# Altium project SLT_110.PrjPcb (part 1 of 3)
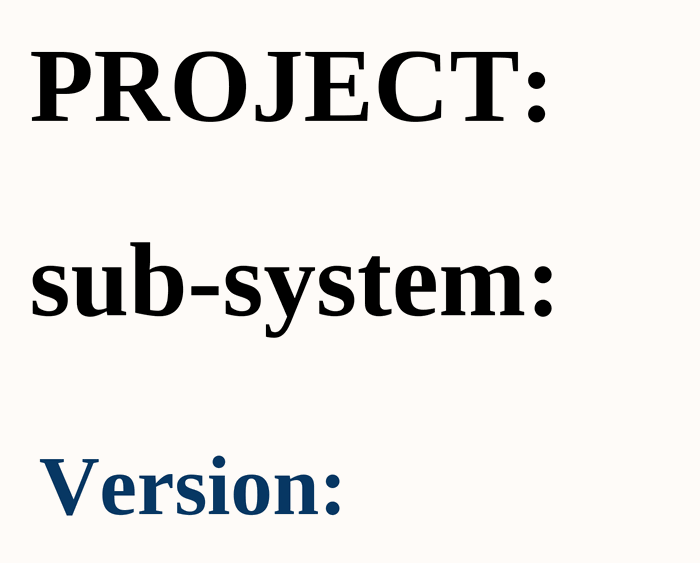
[diagram p0: COVER PAGE.SchDoc]
ApprovedBy: Vu Pham; CheckedBy: Bao Bui; Date: 09/29/2025; DrawnBy: Cam Doan; MasterProject: SLT 6U Satellite; Revision: 1.1.0; SubSystem: SLT 6U Satellite
21 sheets, 876 parts. Net scope: global (net labels, ports and power ports of the same name join across sheets).
Board file: SLT.PcbDoc
Sheets:
  COVER PAGE.SchDoc
  BLOCK DIAGRAM.SchDoc
  INDEX.SchDoc
  CONNECTOR.SchDoc
  POWER.SchDoc
  POWER_2.SchDoc
  SOM_POWER.SchDoc
  SOM_BOOT.SchDoc
  SOM_Console.SchDoc
  IO_EXPAND.SchDoc
  CAN_I2C.SchDoc
  USB.SchDoc
  LED.SchDoc
  TEC.SchDoc
  HEATER.SchDoc
  NTC.SchDoc
  FLUIDIC_CTRL.SchDoc
  SOLEDNOID.SchDoc
  ADC.SchDoc
  I2C_Sensor.SchDoc
  MOUTING.SchDoc

## Sheet COVER PAGE.SchDoc
size 420 x 297 mm; SheetNumber: 1; SheetTotal: 17

### Notes on the sheet
- PROJECT:
- sub-system:
- Version:
- Project:
- Sub-system:
- Design by:
- Sheet title:
- Sheet
- of
- Checked by:
- Approved by:
- Revision:
- Document No:
- Size:
- Date:
- A3

## Sheet BLOCK DIAGRAM.SchDoc
size 420 x 297 mm; SheetNumber: 2; SheetTotal: 17

### Notes on the sheet
- Project:
- Sub-system:
- Design by:
- Sheet title:
- Sheet
- of
- Checked by:
- Approved by:
- Revision:
- Document No:
- Size:
- Date:
- A3

## Sheet INDEX.SchDoc
size 420 x 297 mm; SheetNumber: 3; SheetTotal: 17
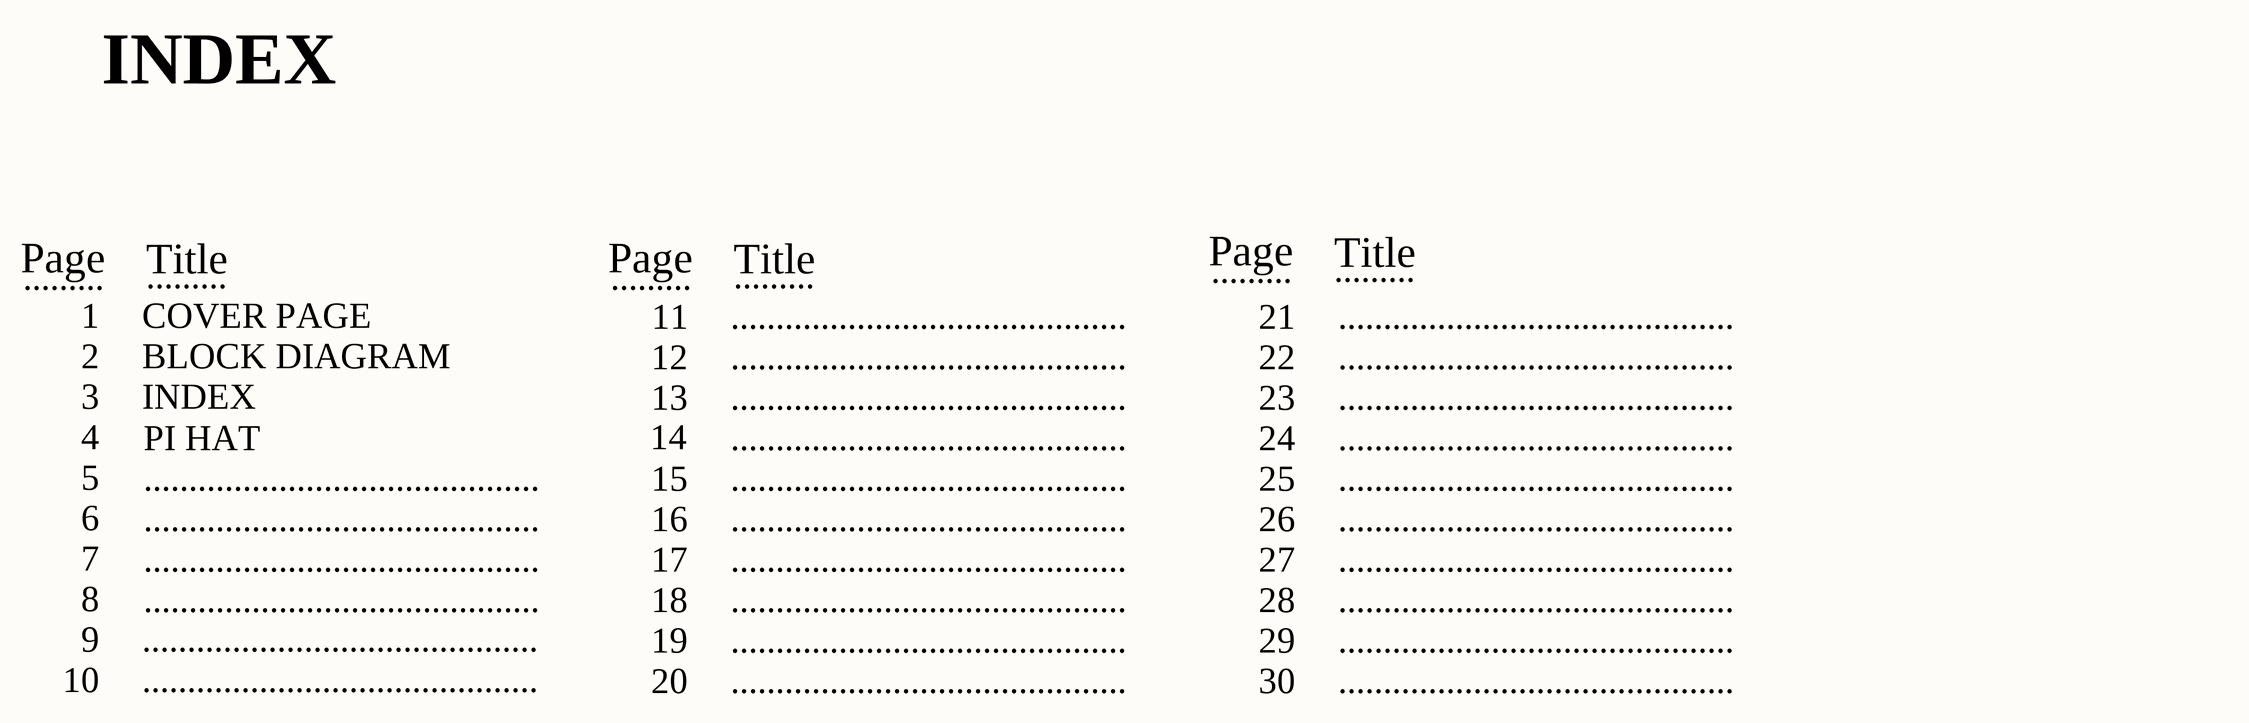
[diagram p1: INDEX.SchDoc]

### Notes on the sheet
- INDEX
- Page
- .........
- Title
- 1
- 2
- COVER PAGE
- BLOCK DIAGRAM
- 11
- 12
- ............................................
- 21
- 22
- 3
- 4
- 14
- 13
- 23
- 5
- PI HAT
- 15
- 24
- 25
- 6
- 7
- 16
- 17
- 26
- 27
- 8
- 18
- 28
- 9
- 10
- 19
- 20
- 29
- 30
- Project:
- Sub-system:
- Design by:
- Sheet title:
- Sheet
- of
- Checked by:
- Approved by:
- Revision:
- Document No:
- Size:
- Date:
- A3

## Sheet CONNECTOR.SchDoc
size 420 x 297 mm; SheetNumber: 4; SheetTotal: 21
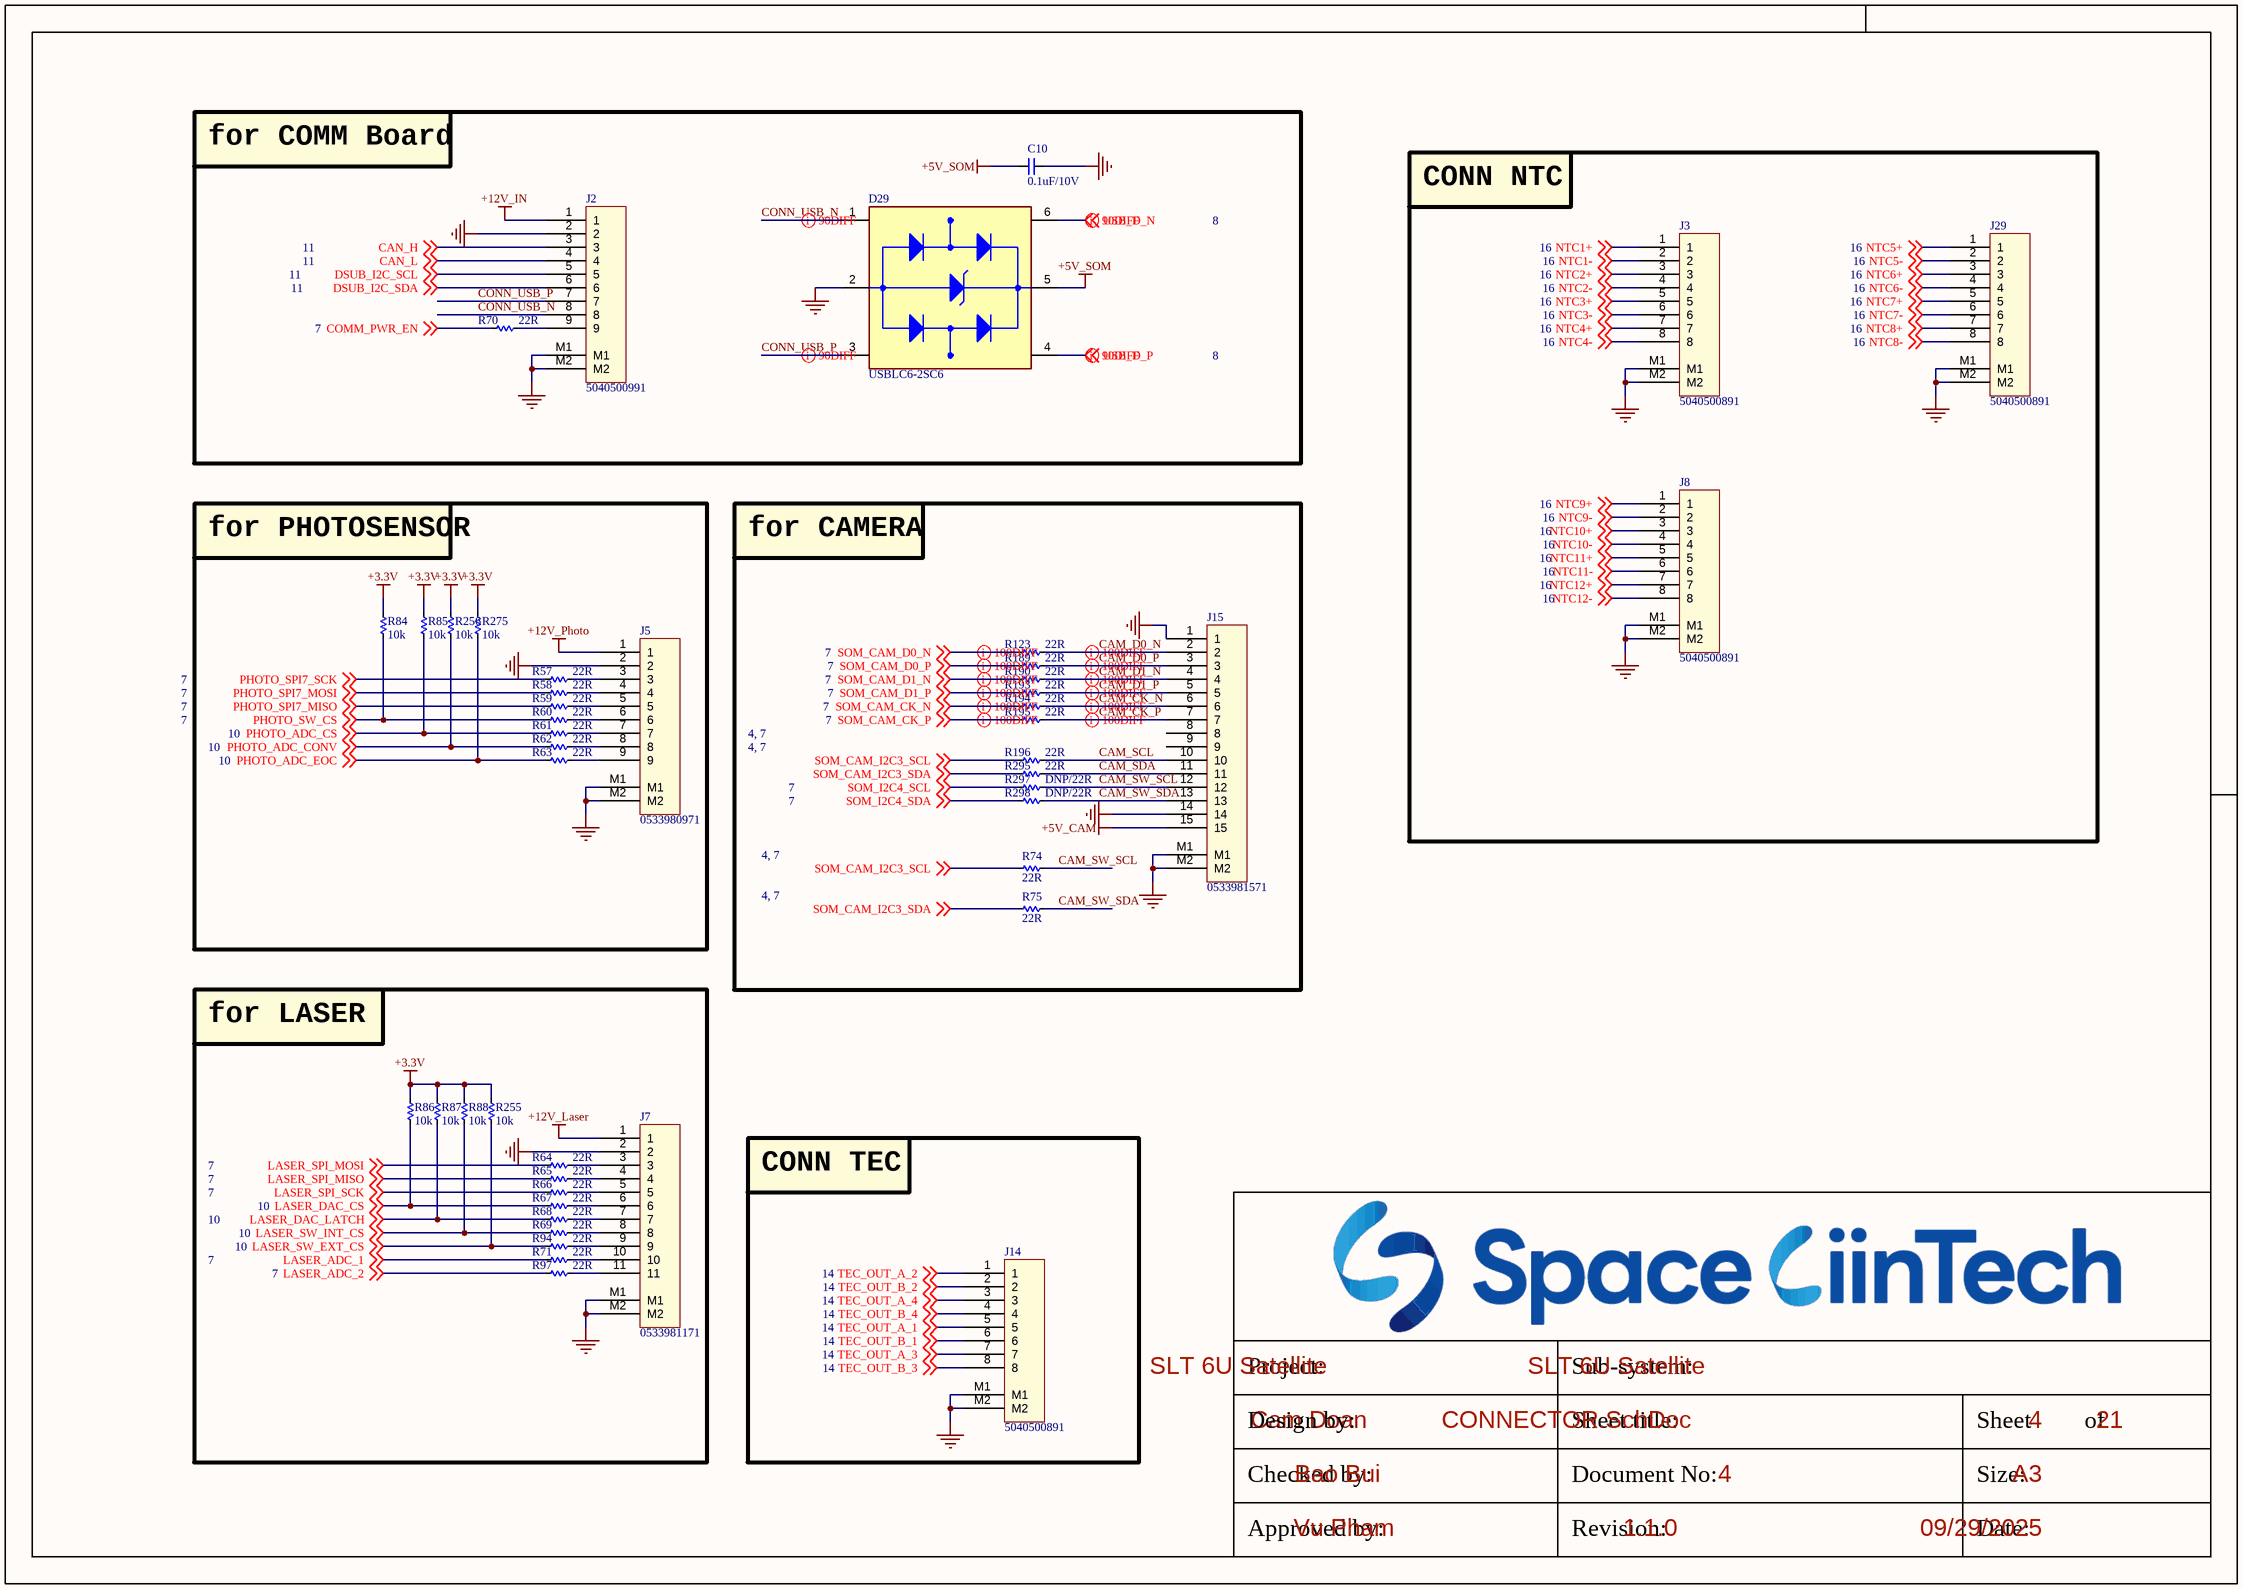
[diagram p2: CONNECTOR.SchDoc]

### Parts
C10  0.1uF/10V  [CAP_C_1005X60]
D29  USBLC6-2SC6  [SOT95P280X145-6N]
J2  5040500991  [Molex_5040500991]
J3  5040500891  [MOLEX_5040500891]
J5  0533980971  [MOLEX_0533980971]
J7  0533981171  [MOLEX_0533981171]
J8  5040500891  [MOLEX_5040500891]
J14  5040500891  [MOLEX_5040500891]
J15  0533981571  [MOLEX_0533981571]
J29  5040500891  [MOLEX_5040500891]
R57  22R  [RES_C_1005X40]
R58  22R  [RES_C_1005X40]
R59  22R  [RES_C_1005X40]
R60  22R  [RES_C_1005X40]
R61  22R  [RES_C_1005X40]
R62  22R  [RES_C_1005X40]
R63  22R  [RES_C_1005X40]
R64  22R  [RES_C_1005X40]
R65  22R  [RES_C_1005X40]
R66  22R  [RES_C_1005X40]
R67  22R  [RES_C_1005X40]
R68  22R  [RES_C_1005X40]
R69  22R  [RES_C_1005X40]
R70  22R  [RES_C_1005X40]
R71  22R  [RES_C_1005X40]
R74  22R  [RES_C_1005X40]
R75  22R  [RES_C_1005X40]
R84  10k  [RES_C_1005X40]
R85  10k  [RES_C_1005X40]
R86  10k  [RES_C_1005X40]
R87  10k  [RES_C_1005X40]
R88  10k  [RES_C_1005X40]
R94  22R  [RES_C_1005X40]
R97  22R  [RES_C_1005X40]
R123  22R  [RES_C_1005X40]
R189  22R  [RES_C_1005X40]
R190  22R  [RES_C_1005X40]
R193  22R  [RES_C_1005X40]
R194  22R  [RES_C_1005X40]
R195  22R  [RES_C_1005X40]
R196  22R  [RES_C_1005X40]
R255  10k  [RES_C_1005X40]
R256  10k  [RES_C_1005X40]
R275  10k  [RES_C_1005X40]
R295  22R  [RES_C_1005X40]
R297  DNP/22R  [RES_C_1005X40]
R298  DNP/22R  [RES_C_1005X40]

### Blocks framed on the sheet
for COMM Board: C10 D29 J2 R70
CONN NTC: J3 J8 J29
for PHOTOSENSOR: J5 R57-R63 R84 R85 R256 R275
for CAMERA: J15 R74 R75 R123 R189 R190 R193-R196 R295 R297 R298
for LASER: J7 R64-R69 R71 R86-R88 R94 R97 R255
CONN TEC: J14

### Nets
+3.3V: R84.1 R85.1 R86.1 R87.1 R88.1 R255.1 R256.1 R275.1
+5V_CAM: J15.15
+5V_SOM: C10.2 D29.5(VBUS)
+12V_IN: J2.1
+12V_Laser: J7.1
+12V_Photo: J5.1
GND: C10.1 D29.2(GND) J2.2 J2.M1 J2.M2 J3.M1 J3.M2 J5.2 J5.M1 J5.M2 J7.2 J7.M1 J7.M2 J8.M1 J8.M2 J14.M1 J14.M2 J15.1 J15.14 J15.M1 J15.M2 J29.M1 J29.M2
NTC1+: J3.1 J3.3 J3.5 J3.7 J8.1 J8.3 J8.5 J8.7 J29.1 J29.3 J29.5 J29.7 ; off-sheet NTC1+, off-sheet NTC2+, off-sheet NTC3+, off-sheet NTC4+, off-sheet NTC5+, off-sheet NTC6+, off-sheet NTC7+, off-sheet NTC8+, off-sheet NTC9+, off-sheet NTC10+, off-sheet NTC11+, off-sheet NTC12+  [also labelled NTC10+, NTC11+, NTC12+, NTC2+, NTC3+, NTC4+, NTC5+, NTC6+, NTC7+, NTC8+, NTC9+]
CAM_CK_N: J15.6 R194.2
CAM_CK_P: J15.7 R195.2
CAM_D0_N: J15.2 R123.2
CAM_D0_P: J15.3 R189.2
CAM_D1_N: J15.4 R190.2
CAM_D1_P: J15.5 R193.2
CAM_SCL: J15.10 R196.2
CAM_SDA: J15.11 R295.2
CAM_SW_SCL: J15.12 R74.1 R297.2
CAM_SW_SDA: J15.13 R75.1 R298.2
CAN_H: J2.3 ; off-sheet CAN_H
CAN_L: J2.4 ; off-sheet CAN_L
COMM_PWR_EN: R70.1 ; off-sheet COMM_PWR_EN
CONN_USB_N: D29.1(I/O1_IN) J2.8
CONN_USB_P: D29.3(I/O2_IN) J2.7
DSUB_I2C_SCL: J2.5 ; off-sheet DSUB_I2C_SCL
DSUB_I2C_SDA: J2.6 ; off-sheet DSUB_I2C_SDA
LASER_ADC_1: R71.1 ; off-sheet LASER_ADC_1
LASER_ADC_2: R97.1 ; off-sheet LASER_ADC_2
LASER_DAC_CS: R67.1 R86.2 ; off-sheet LASER_DAC_CS
LASER_DAC_LATCH: R68.1 R87.2 ; off-sheet LASER_DAC_LATCH
LASER_SPI_MISO: R65.1 ; off-sheet LASER_SPI_MISO  [project net SPI1_MISO]
LASER_SPI_MOSI: R64.1 ; off-sheet LASER_SPI_MOSI  [project net SPI1_MOSI]
LASER_SPI_SCK: R66.1 ; off-sheet LASER_SPI_SCK  [project net SPI1_SCK]
LASER_SW_EXT_CS: R94.1 R255.2 ; off-sheet LASER_SW_EXT_CS
LASER_SW_INT_CS: R69.1 R88.2 ; off-sheet LASER_SW_INT_CS
NTC1-: J3.2 ; off-sheet NTC1-
NTC2-: J3.4 ; off-sheet NTC2-
NTC3-: J3.6 ; off-sheet NTC3-
NTC4-: J3.8 ; off-sheet NTC4-
NTC5-: J29.2 ; off-sheet NTC5-
NTC6-: J29.4 ; off-sheet NTC6-
NTC7-: J29.6 ; off-sheet NTC7-
NTC8-: J29.8 ; off-sheet NTC8-
NTC9-: J8.2 ; off-sheet NTC9-
NTC10-: J8.4 ; off-sheet NTC10-
NTC11-: J8.6 ; off-sheet NTC11-
NTC12-: J8.8 ; off-sheet NTC12-
PHOTO_ADC_CONV: R62.1 R256.2 ; off-sheet PHOTO_ADC_CONV
PHOTO_ADC_CS: R61.1 R85.2 ; off-sheet PHOTO_ADC_CS
PHOTO_ADC_EOC: R63.1 R275.2 ; off-sheet PHOTO_ADC_EOC
PHOTO_SPI7_MISO: R59.1 ; off-sheet PHOTO_SPI7_MISO
PHOTO_SPI7_MOSI: R58.1 ; off-sheet PHOTO_SPI7_MOSI
PHOTO_SPI7_SCK: R57.1 ; off-sheet PHOTO_SPI7_SCK
PHOTO_SW_CS: R60.1 R84.2 ; off-sheet PHOTO_SW_CS
SOM_CAM_CK_N: R194.1 ; off-sheet SOM_CAM_CK_N
SOM_CAM_CK_P: R195.1 ; off-sheet SOM_CAM_CK_P
SOM_CAM_D0_N: R123.1 ; off-sheet SOM_CAM_D0_N
SOM_CAM_D0_P: R189.1 ; off-sheet SOM_CAM_D0_P
SOM_CAM_D1_N: R190.1 ; off-sheet SOM_CAM_D1_N
SOM_CAM_D1_P: R193.1 ; off-sheet SOM_CAM_D1_P
SOM_CAM_I2C3_SCL: R74.2 R196.1 ; off-sheet SOM_CAM_I2C3_SCL
SOM_CAM_I2C3_SDA: R75.2 R295.1 ; off-sheet SOM_CAM_I2C3_SDA
SOM_I2C4_SCL: R297.1 ; off-sheet SOM_I2C4_SCL  [project net I2C4_SCL]
SOM_I2C4_SDA: R298.1 ; off-sheet SOM_I2C4_SDA  [project net I2C4_SDA]
TEC_OUT_A_1: J14.5 ; off-sheet TEC_OUT_A_1
TEC_OUT_A_2: J14.1 ; off-sheet TEC_OUT_A_2
TEC_OUT_A_3: J14.7 ; off-sheet TEC_OUT_A_3
TEC_OUT_A_4: J14.3 ; off-sheet TEC_OUT_A_4
TEC_OUT_B_1: J14.6 ; off-sheet TEC_OUT_B_1
TEC_OUT_B_2: J14.2 ; off-sheet TEC_OUT_B_2
TEC_OUT_B_3: J14.8 ; off-sheet TEC_OUT_B_3
TEC_OUT_B_4: J14.4 ; off-sheet TEC_OUT_B_4
USB_D_N: D29.6(I/O1_OUT) ; off-sheet USB_D_N
USB_D_P: D29.4(I/O2_OUT) ; off-sheet USB_D_P
NetJ2_9: J2.9 R70.2
NetJ5_3: J5.3 R57.2
NetJ5_4: J5.4 R58.2
NetJ5_5: J5.5 R59.2
NetJ5_6: J5.6 R60.2
NetJ5_7: J5.7 R61.2
NetJ5_8: J5.8 R62.2
NetJ5_9: J5.9 R63.2
NetJ7_3: J7.3 R64.2
NetJ7_4: J7.4 R65.2
NetJ7_5: J7.5 R66.2
NetJ7_6: J7.6 R67.2
NetJ7_7: J7.7 R68.2
NetJ7_8: J7.8 R69.2
NetJ7_9: J7.9 R94.2
NetJ7_10: J7.10 R71.2
NetJ7_11: J7.11 R97.2

Not connected (* = marked no-connect by the designer): J15 8 9

### Layout directives
differential pair; differential pair class DIFF90: CONN_USB_N, CONN_USB_P, USB_D_N, USB_D_P
differential pair; differential pair class DIFF100: CAM_CK_N, CAM_CK_P, CAM_D0_N, CAM_D0_P, CAM_D1_N, CAM_D1_P, SOM_CAM_CK_N, SOM_CAM_CK_P, SOM_CAM_D0_N, SOM_CAM_D0_P, SOM_CAM_D1_N, SOM_CAM_D1_P

### Notes on the sheet
- Project:
- Sub-system:
- Design by:
- Sheet title:
- Sheet
- of
- Checked by:
- Approved by:
- Revision:
- Document No:
- Size:
- Date:
- A3

### Library data of the parts
C10 = _CAP_C_2: CAP CHIP
D29 = USBLC6-2SC6: 17V Clamp 5A (8/20Âµs) Ipp Tvs Diode Surface Mount SOT-23-6; MF: STMicroelectronics; Value: *; SnapEDA_Link: https://www.snapeda.com/parts/USBLC6-2SC6/STMicroelectronics/view-part/?ref=snap; Check_prices: https://www.snapeda.com/parts/USBLC6-2SC6/STMicroelectronics/view-part/?ref=eda; Purchase-URL: https://pricing.snapeda.com/search/part/USBLC6-2SC6/?ref=eda; Price: None; Availability: In Stock; Package: SOT-23-6 STMicroelectronics; MP: USBLC6-2SC6
J2 J5 = Header 9x1_2M
J3 J8 J14 J29 = Header 8x1_2M
J7 = Header 11x1_2M
J15 = Header 15x1_2M
R57-R71 R74 R75 R84-R88 R94 R97 R123 R189 R190 R193-R196 R255 R256 R275 R295 R297 R298 = _RES_B_2: RES

## Sheet POWER.SchDoc
size 420 x 297 mm; SheetNumber: 5; SheetTotal: 21
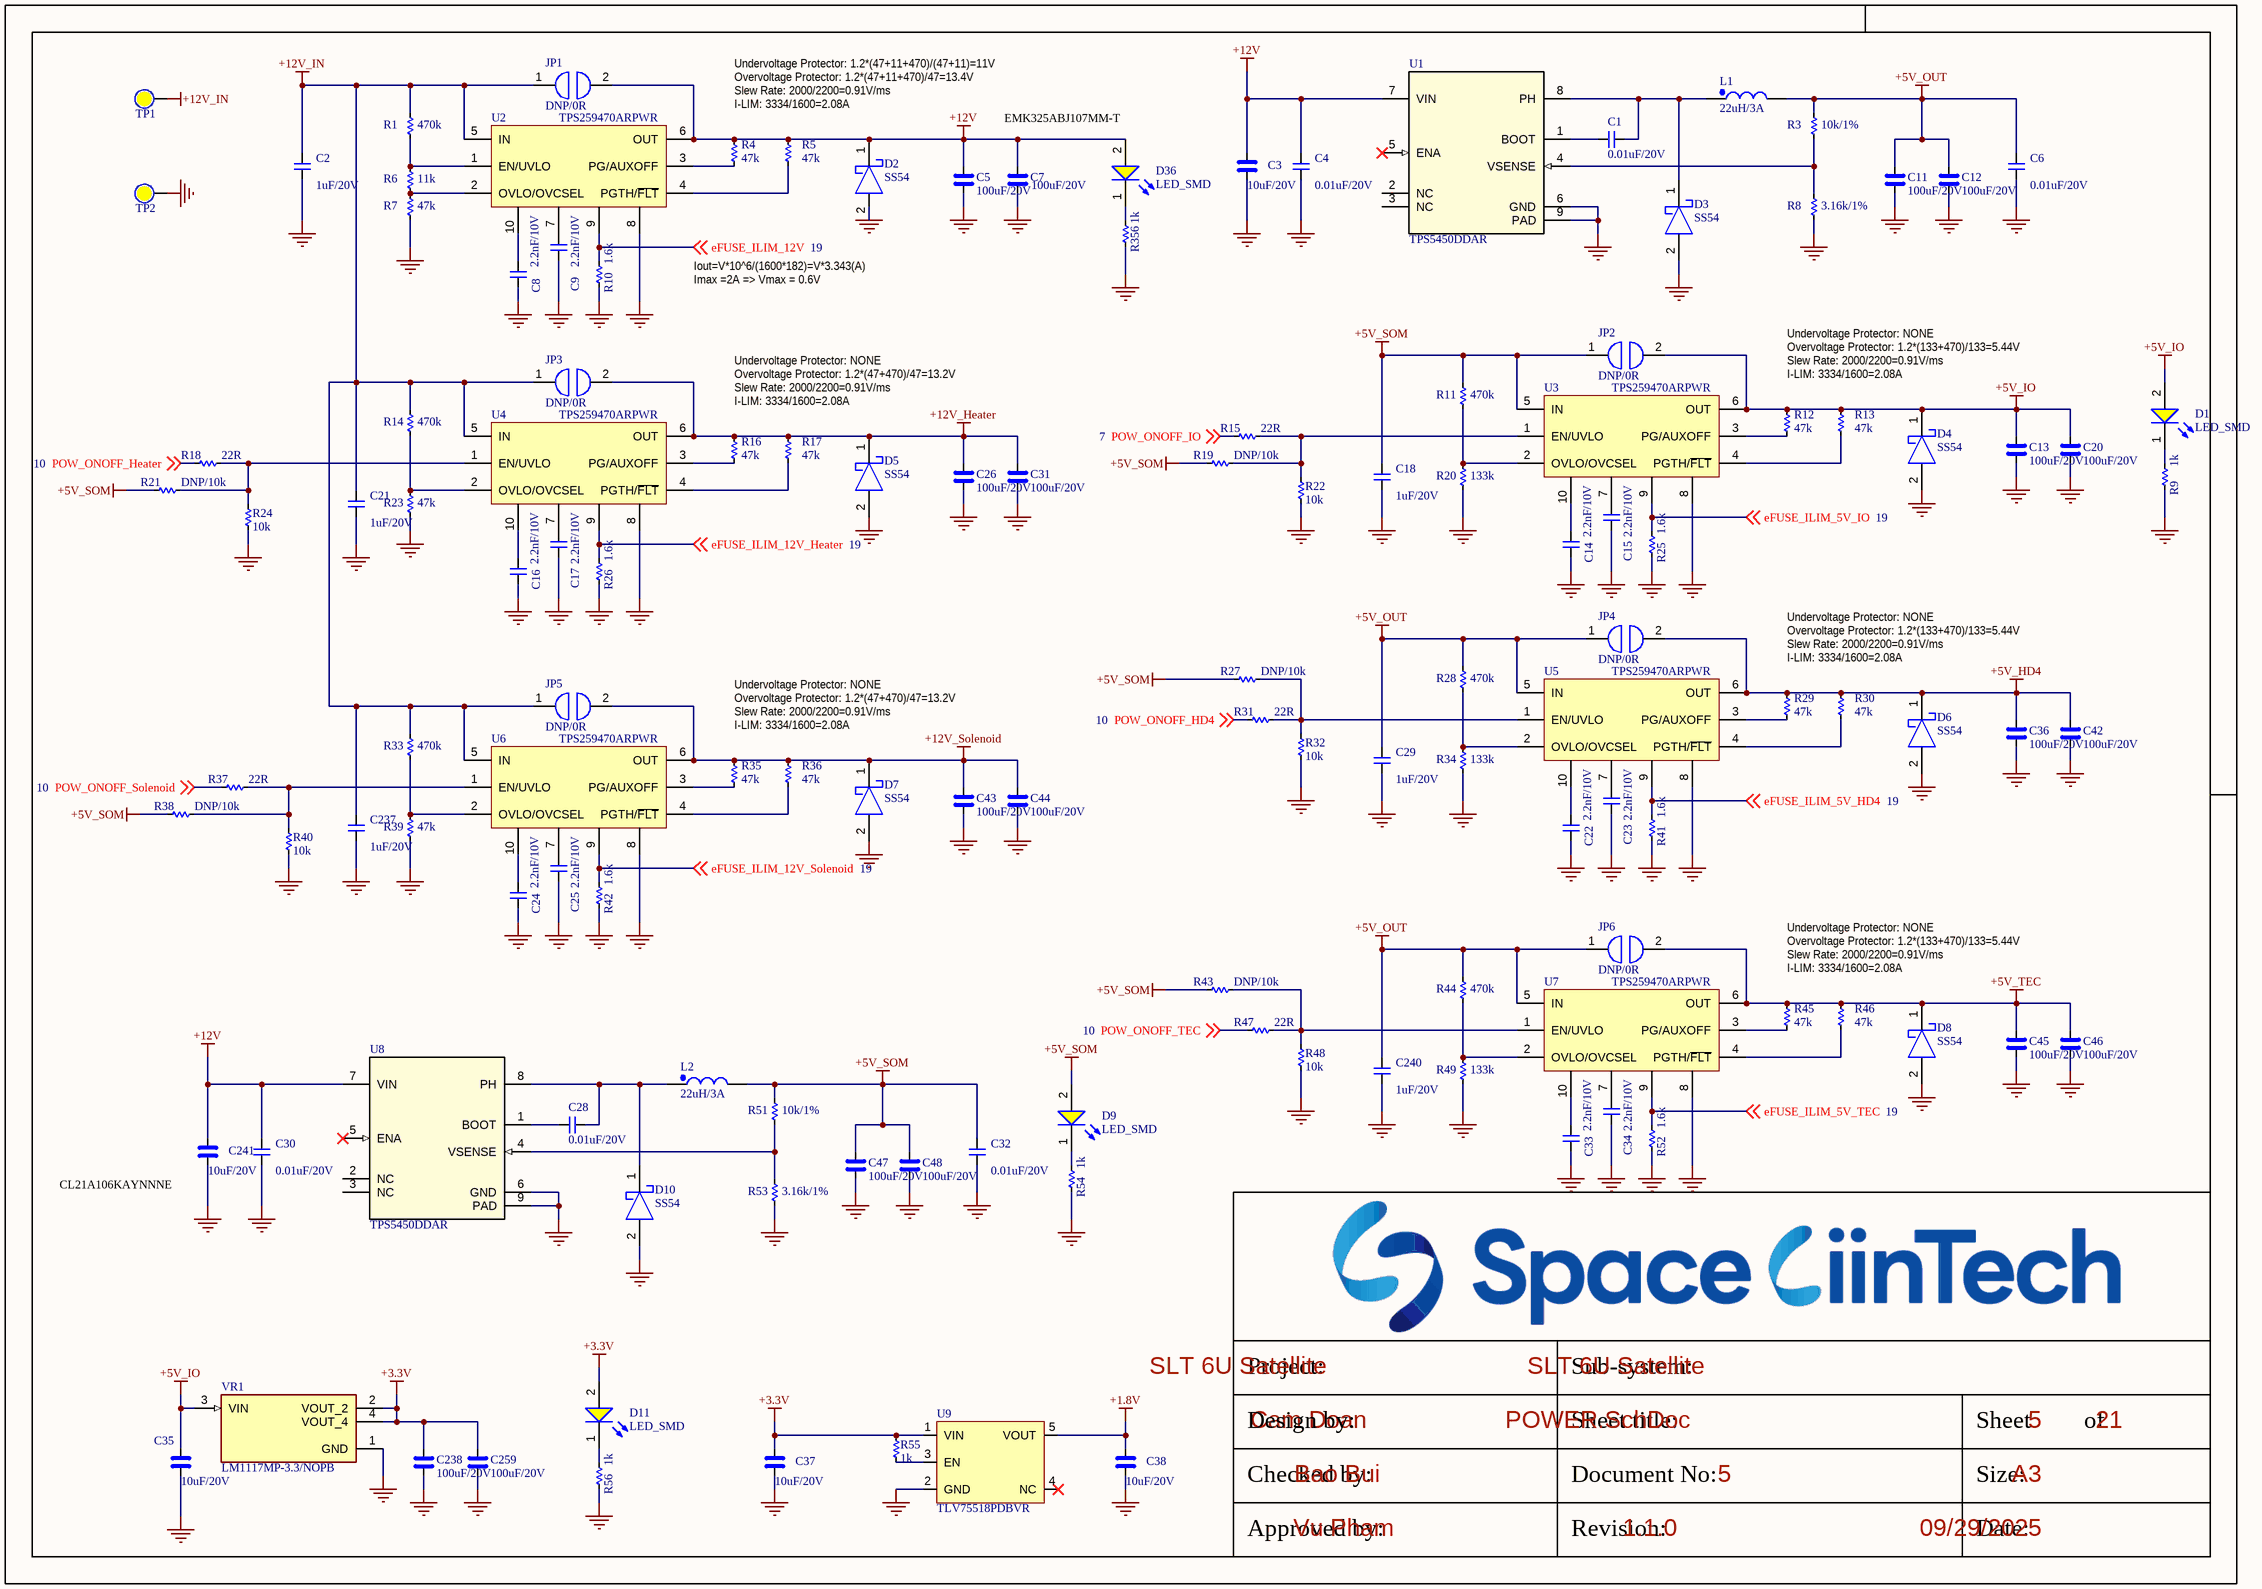
[diagram p3: POWER.SchDoc]

### Parts
C1  0.01uF/20V  [CAP_C_1005X60]
C2  1uF/20V  [CAP_C_1005X60]
C3  10uF/20V  [CAP_C_2012X110]
C4  0.01uF/20V  [CAP_C_1005X60]
C5  100uF/20V  [CAP_C_3225X80]
C6  0.01uF/20V  [CAP_C_1005X60]
C7  100uF/20V  [CAP_C_3225X80]
C8  2.2nF/10V  [CAP_C_1005X60]
C9  2.2nF/10V  [CAP_C_1005X60]
C11  100uF/20V  [CAP_C_3225X80]
C12  100uF/20V  [CAP_C_3225X80]
C13  100uF/20V  [CAP_C_3225X80]
C14  2.2nF/10V  [CAP_C_1005X60]
C15  2.2nF/10V  [CAP_C_1005X60]
C16  2.2nF/10V  [CAP_C_1005X60]
C17  2.2nF/10V  [CAP_C_1005X60]
C18  1uF/20V  [CAP_C_1005X60]
C20  100uF/20V  [CAP_C_3225X80]
C21  1uF/20V  [CAP_C_1005X60]
C22  2.2nF/10V  [CAP_C_1005X60]
C23  2.2nF/10V  [CAP_C_1005X60]
C24  2.2nF/10V  [CAP_C_1005X60]
C25  2.2nF/10V  [CAP_C_1005X60]
C26  100uF/20V  [CAP_C_3225X80]
C28  0.01uF/20V  [CAP_C_1005X60]
C29  1uF/20V  [CAP_C_1005X60]
C30  0.01uF/20V  [CAP_C_1005X60]
C31  100uF/20V  [CAP_C_3225X80]
C32  0.01uF/20V  [CAP_C_1005X60]
C33  2.2nF/10V  [CAP_C_1005X60]
C34  2.2nF/10V  [CAP_C_1005X60]
C35  10uF/20V  [CAP_C_2012X110]
C36  100uF/20V  [CAP_C_3225X80]
C37  10uF/20V  [CAP_C_2012X110]
C38  10uF/20V  [CAP_C_2012X110]
C42  100uF/20V  [CAP_C_3225X80]
C43  100uF/20V  [CAP_C_3225X80]
C44  100uF/20V  [CAP_C_3225X80]
C45  100uF/20V  [CAP_C_3225X80]
C46  100uF/20V  [CAP_C_3225X80]
C47  100uF/20V  [CAP_C_3225X80]
C48  100uF/20V  [CAP_C_3225X80]
C237  1uF/20V  [CAP_C_1005X60]
C238  100uF/20V  [CAP_C_3225X80]
C240  1uF/20V  [CAP_C_1005X60]
C241  10uF/20V  [CAP_C_2012X110]
C259  100uF/20V  [CAP_C_3225X80]
D1  LED_SMD  [LED_0603]
D2  SS54  [DO-214AC_SMA]
D3  SS54  [DO-214AC_SMA]
D4  SS54  [DO-214AC_SMA]
D5  SS54  [DO-214AC_SMA]
D6  SS54  [DO-214AC_SMA]
D7  SS54  [DO-214AC_SMA]
D8  SS54  [DO-214AC_SMA]
D9  LED_SMD  [LED_0603]
D10  SS54  [DO-214AC_SMA]
D11  LED_SMD  [LED_0603]
D36  LED_SMD  [LED_0603]
JP1  DNP/0R  [RES_C_1608X60]
JP2  DNP/0R  [RES_C_1608X60]
JP3  DNP/0R  [RES_C_1608X60]
JP4  DNP/0R  [RES_C_1608X60]
JP5  DNP/0R  [RES_C_1608X60]
JP6  DNP/0R  [RES_C_1608X60]
L1  22uH/3A  [IND730660x480]
L2  22uH/3A  [IND730660x480]
R1  470k  [RES_C_1005X40]
R3  10k/1%  [RES_C_1005X40]
R4  47k  [RES_C_1005X40]
R5  47k  [RES_C_1005X40]
R6  11k  [RES_C_1005X40]
R7  47k  [RES_C_1005X40]
R8  3.16k/1%  [RES_C_1005X40]
R9  1k  [RES_C_1005X40]
R10  1.6k  [RES_C_1005X40]
R11  470k  [RES_C_1005X40]
R12  47k  [RES_C_1005X40]
R13  47k  [RES_C_1005X40]
R14  470k  [RES_C_1005X40]
R15  22R  [RES_C_1005X40]
R16  47k  [RES_C_1005X40]
R17  47k  [RES_C_1005X40]
R18  22R  [RES_C_1005X40]
R19  DNP/10k  [RES_C_1005X40]
R20  133k  [RES_C_1005X40]
R21  DNP/10k  [RES_C_1005X40]
R22  10k  [RES_C_1005X40]
R23  47k  [RES_C_1005X40]
R24  10k  [RES_C_1005X40]
R25  1.6k  [RES_C_1005X40]
R26  1.6k  [RES_C_1005X40]
R27  DNP/10k  [RES_C_1005X40]
R28  470k  [RES_C_1005X40]
R29  47k  [RES_C_1005X40]
R30  47k  [RES_C_1005X40]
R31  22R  [RES_C_1005X40]
R32  10k  [RES_C_1005X40]
R33  470k  [RES_C_1005X40]
R34  133k  [RES_C_1005X40]
R35  47k  [RES_C_1005X40]
R36  47k  [RES_C_1005X40]
R37  22R  [RES_C_1005X40]
R38  DNP/10k  [RES_C_1005X40]
R39  47k  [RES_C_1005X40]
R40  10k  [RES_C_1005X40]
R41  1.6k  [RES_C_1005X40]
R42  1.6k  [RES_C_1005X40]
R43  DNP/10k  [RES_C_1005X40]
R44  470k  [RES_C_1005X40]
R45  47k  [RES_C_1005X40]
R46  47k  [RES_C_1005X40]
R47  22R  [RES_C_1005X40]
R48  10k  [RES_C_1005X40]
R49  133k  [RES_C_1005X40]
R51  10k/1%  [RES_C_1005X40]
R52  1.6k  [RES_C_1005X40]
R53  3.16k/1%  [RES_C_1005X40]
R54  1k  [RES_C_1005X40]
R55  1k  [RES_C_1005X40]
R56  1k  [RES_C_1005X40]
R356  1k  [RES_C_1005X40]
TP1  (no value)  [Testpoint_TH_D130H80]  (no BOM)
TP2  (no value)  [Testpoint_TH_D130H80]  (no BOM)
U1  TPS5450DDAR  [DDA0008J]
U2  TPS259470ARPWR  [VQFN-HR-10]
U3  TPS259470ARPWR  [VQFN-HR-10]
U4  TPS259470ARPWR  [VQFN-HR-10]
U5  TPS259470ARPWR  [VQFN-HR-10]
U6  TPS259470ARPWR  [VQFN-HR-10]
U7  TPS259470ARPWR  [VQFN-HR-10]
U8  TPS5450DDAR  [DDA0008J]
U9  TLV75518PDBVR  [SOT25]
VR1  LM1117MP-3.3/NOPB  [VREG_LM1117MP-3.3/NOPB]

### Nets
+1.8V: C38.1 U9.5(VOUT)
+3.3V: C37.1 C238.2 C259.2 D11.2(A) R55.2 U9.1(VIN) VR1.2(VOUT_2) VR1.4(VOUT_4)
+5V_HD4: C36.2 C42.2 D6.1 JP4.2 R29.2 R30.2 U5.6(OUT)
+5V_IO: C13.2 C20.2 C35.1 D1.2(A) D4.1 JP2.2 R12.2 R13.2 U3.6(OUT) VR1.3(VIN)  [project net NTC1+]
+5V_OUT: C6.2 C11.2 C12.2 C29.2 C240.2 JP4.1 JP6.1 L1.2 R3.2 R28.2 R44.2 U5.5(IN) U7.5(IN)
+5V_SOM: C18.2 C32.2 C47.2 C48.2 D9.2(A) JP2.1 L2.2 R11.2 R19.2 R21.2 R27.2 R38.2 R43.2 R51.2 U3.5(IN)
+5V_TEC: C45.2 C46.2 D8.1 JP6.2 R45.2 R46.2 U7.6(OUT)
+12V: C3.1 C4.2 C5.2 C7.2 C30.2 C241.1 D2.1 D36.2(A) JP1.2 R4.2 R5.2 U1.7(VIN) U2.6(OUT) U8.7(VIN)
+12V_Heater: C26.2 C31.2 D5.1 JP3.2 R16.2 R17.2 U4.6(OUT)
+12V_IN: C2.2 C21.2 C237.2 JP1.1 JP3.1 JP5.1 R1.2 R14.2 R33.2 TP1.0 U2.5(IN) U4.5(IN) U6.5(IN)
+12V_Solenoid: C43.2 C44.2 D7.1 JP5.2 R35.2 R36.2 U6.6(OUT)
GND: C2.1 C3.2 C4.1 C5.1 C6.1 C7.1 C8.1 C9.1 C11.1 C12.1 C13.1 C14.1 C15.1 C16.1 C17.1 C18.1 C20.1 C21.1 C22.1 C23.1 C24.1 C25.1 C26.1 C29.1 C30.1 C31.1 C32.1 C33.1 C34.1 C35.2 C36.1 C37.2 C38.2 C42.1 C43.1 C44.1 C45.1 C46.1 C47.1 C48.1 C237.1 C238.1 C240.1 C241.2 C259.1 D2.2 D3.2 D4.2 D5.2 D6.2 D7.2 D8.2 D10.2 R7.1 R8.1 R9.1 R10.1 R20.1 R22.2 R23.1 R24.2 R25.1 R26.1 R32.2 R34.1 R39.1 R40.2 R41.1 R42.1 R48.2 R49.1 R52.1 R53.1 R54.1 R56.1 R356.1 TP2.0 U1.6(GND) U1.9(PAD) U2.8 U3.8 U4.8 U5.8 U6.8 U7.8 U8.6(GND) U8.9(PAD) U9.2(GND) VR1.1(GND)
eFUSE_ILIM_5V_HD4: R41.2 U5.9 ; off-sheet eFUSE_ILIM_5V_HD4
eFUSE_ILIM_5V_IO: R25.2 U3.9 ; off-sheet eFUSE_ILIM_5V_IO
eFUSE_ILIM_5V_TEC: R52.2 U7.9 ; off-sheet eFUSE_ILIM_5V_TEC
eFUSE_ILIM_12V: R10.2 U2.9 ; off-sheet eFUSE_ILIM_12V
eFUSE_ILIM_12V_Heater: R26.2 U4.9 ; off-sheet eFUSE_ILIM_12V_Heater
eFUSE_ILIM_12V_Solenoid: R42.2 U6.9 ; off-sheet eFUSE_ILIM_12V_Solenoid
POW_ONOFF_HD4: R31.2 ; off-sheet POW_ONOFF_HD4
POW_ONOFF_Heater: R18.2 ; off-sheet POW_ONOFF_Heater
POW_ONOFF_IO: R15.2 ; off-sheet POW_ONOFF_IO
POW_ONOFF_Solenoid: R37.2 ; off-sheet POW_ONOFF_Solenoid
POW_ONOFF_TEC: R47.2 ; off-sheet POW_ONOFF_TEC
NetC1_1: C1.1 D3.1 L1.1 U1.8(PH)
NetC1_2: C1.2 U1.1(BOOT)
NetC8_2: C8.2 U2.10
NetC9_2: C9.2 U2.7
NetC14_2: C14.2 U3.10
NetC15_2: C15.2 U3.7
NetC16_2: C16.2 U4.10
NetC17_2: C17.2 U4.7
NetC22_2: C22.2 U5.10
NetC23_2: C23.2 U5.7
NetC24_2: C24.2 U6.10
NetC25_2: C25.2 U6.7
NetC28_1: C28.1 D10.1 L2.1 U8.8(PH)
NetC28_2: C28.2 U8.1(BOOT)
NetC33_2: C33.2 U7.10
NetC34_2: C34.2 U7.7
NetD1_1: D1.1(K) R9.2
NetD9_1: D9.1(K) R54.2
NetD11_1: D11.1(K) R56.2
NetD36_1: D36.1(K) R356.2
NetR1_1: R1.1 R6.2 U2.1(EN/UVLO)
NetR3_1: R3.1 R8.2 U1.4(VSENSE)
NetR4_1: R4.1 U2.3(PG/AUXOFF)
NetR5_1: R5.1 U2.4(PGTH/~{FLT})
NetR6_1: R6.1 R7.2 U2.2(OVLO/OVCSEL)
NetR11_1: R11.1 R20.2 U3.2(OVLO/OVCSEL)
NetR12_1: R12.1 U3.3(PG/AUXOFF)
NetR13_1: R13.1 U3.4(PGTH/~{FLT})
NetR14_1: R14.1 R23.2 U4.2(OVLO/OVCSEL)
NetR15_1: R15.1 R19.1 R22.1 U3.1(EN/UVLO)
NetR16_1: R16.1 U4.3(PG/AUXOFF)
NetR17_1: R17.1 U4.4(PGTH/~{FLT})
NetR18_1: R18.1 R21.1 R24.1 U4.1(EN/UVLO)
NetR27_1: R27.1 R31.1 R32.1 U5.1(EN/UVLO)
NetR28_1: R28.1 R34.2 U5.2(OVLO/OVCSEL)
NetR29_1: R29.1 U5.3(PG/AUXOFF)
NetR30_1: R30.1 U5.4(PGTH/~{FLT})
NetR33_1: R33.1 R39.2 U6.2(OVLO/OVCSEL)
NetR35_1: R35.1 U6.3(PG/AUXOFF)
NetR36_1: R36.1 U6.4(PGTH/~{FLT})
NetR37_1: R37.1 R38.1 R40.1 U6.1(EN/UVLO)
NetR43_1: R43.1 R47.1 R48.1 U7.1(EN/UVLO)
NetR44_1: R44.1 R49.2 U7.2(OVLO/OVCSEL)
NetR45_1: R45.1 U7.3(PG/AUXOFF)
NetR46_1: R46.1 U7.4(PGTH/~{FLT})
NetR51_1: R51.1 R53.2 U8.4(VSENSE)
NetR55_1: R55.1 U9.3(EN)

Not connected (* = marked no-connect by the designer): U1 2(NC) 3(NC) 5(ENA)*; U8 2(NC) 3(NC) 5(ENA)*; U9 4(NC)*

### Notes on the sheet
- Undervoltage Protector: 1.2*(47+11+470)/(47+11)=11V
- Overvoltage Protector: 1.2*(47+11+470)/47=13.4V
- Slew Rate: 2000/2200=0.91V/ms
- I-LIM: 3334/1600=2.08A
- EMK325ABJ107MM-T
- Iout=V*10^6/(1600*182)=V*3.343(A)
- Imax =2A => Vmax = 0.6V
- Undervoltage Protector: NONE
- Overvoltage Protector: 1.2*(47+470)/47=13.2V
- Overvoltage Protector: 1.2*(133+470)/133=5.44V
- (near C241) CL21A106KAYNNNE
- Project:
- Sub-system:
- Design by:
- Sheet title:
- Sheet
- of
- Checked by:
- Approved by:
- Revision:
- Document No:
- Size:
- Date:
- A3

### Library data of the parts
C1 C2 C4 C6 C8 C9 C14-C18 C21-C25 C28-C30 C32-C34 C237 C240 = _CAP_C_2: CAP CHIP
C3 C5 C7 C11-C13 C20 C26 C31 C35-C38 C42-C48 C238 C241 C259 = _CAP_C_High_2: CAP CHIP High Value
D2-D8 D10 = SS54: DIODE SCHOTTKY 60V 3A DO214AA
JP1-JP6 = JUMPER
L1 L2 = _IND: SRP7050TA-100M
R1 R3-R49 R51-R56 R356 = _RES_B_2: RES
TP1 TP2 = Test Point: Solder: NF
U1 U8 = TPS5430DDAR: No Description Available; Mfr_Name: Texas Instruments; TYPE: TYPE; RefDes: RefDes
U9 = IC_POWER_AP7347DQ
VR1 = LM1117MP-3.3/NOPB: 800-mA 15-V linear voltage regulator; MF: Texas Instruments; SnapEDA_Link: https://www.snapeda.com/parts/LM1117MP-3.3/NOPB/Texas+Instruments/view-part/?ref=snap; Package: SOT-223-4 Texas Instruments; Value: *; MP: LM1117MP-3.3/NOPB; Check_prices: https://www.snapeda.com/parts/LM1117MP-3.3/NOPB/Texas+Instruments/view-part/?ref=eda

## Sheet POWER_2.SchDoc
size 420 x 297 mm; SheetNumber: 6; SheetTotal: 19
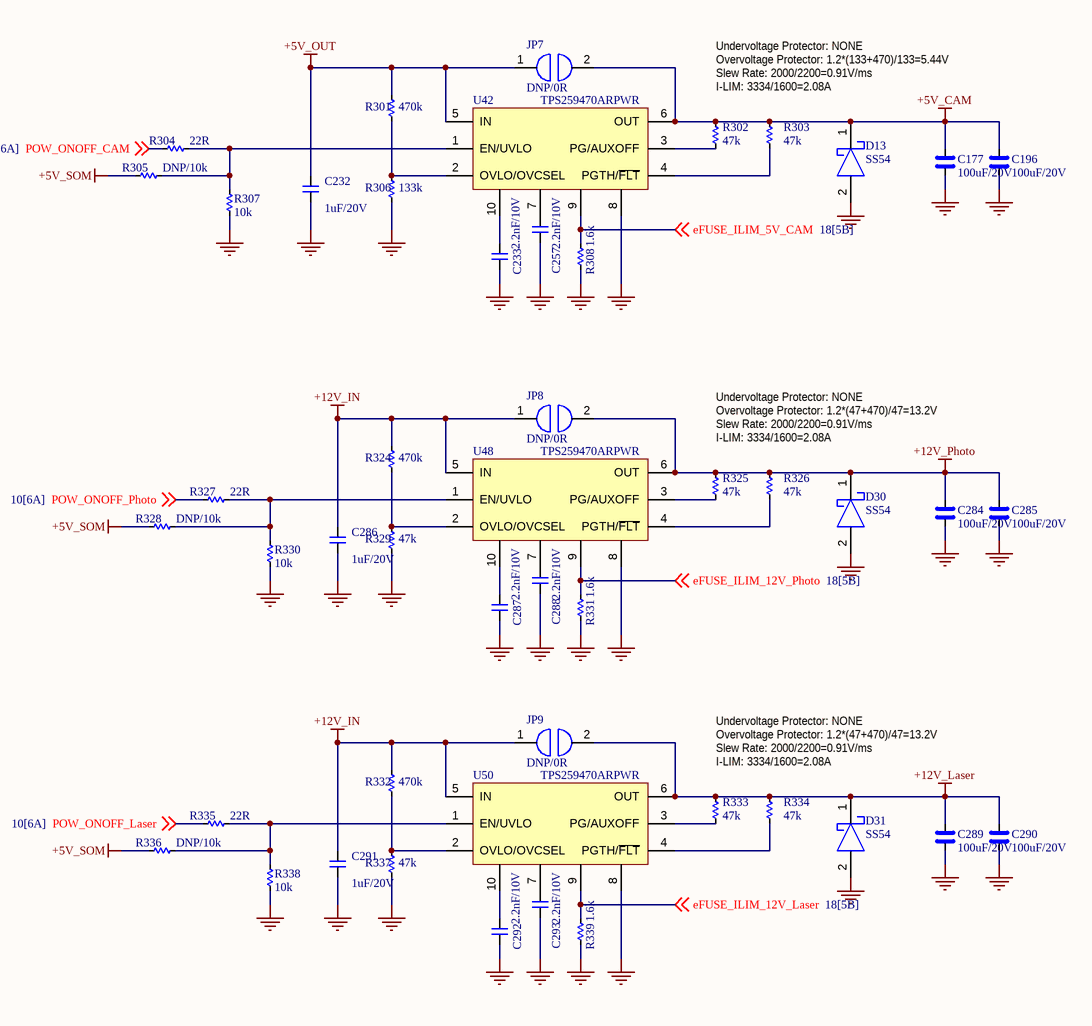
[diagram p4: POWER_2.SchDoc]

### Parts
C177  100uF/20V  [CAP_C_3225X80]
C196  100uF/20V  [CAP_C_3225X80]
C232  1uF/20V  [CAP_C_1005X60]
C233  2.2nF/10V  [CAP_C_1005X60]
C257  2.2nF/10V  [CAP_C_1005X60]
C284  100uF/20V  [CAP_C_3225X80]
C285  100uF/20V  [CAP_C_3225X80]
C286  1uF/20V  [CAP_C_1005X60]
C287  2.2nF/10V  [CAP_C_1005X60]
C288  2.2nF/10V  [CAP_C_1005X60]
C289  100uF/20V  [CAP_C_3225X80]
C290  100uF/20V  [CAP_C_3225X80]
C291  1uF/20V  [CAP_C_1005X60]
C292  2.2nF/10V  [CAP_C_1005X60]
C293  2.2nF/10V  [CAP_C_1005X60]
D13  SS54  [DO-214AC_SMA]
D30  SS54  [DO-214AC_SMA]
D31  SS54  [DO-214AC_SMA]
JP7  DNP/0R  [RES_C_1608X60]
JP8  DNP/0R  [RES_C_1608X60]
JP9  DNP/0R  [RES_C_1608X60]
R301  470k  [RES_C_1005X40]
R302  47k  [RES_C_1005X40]
R303  47k  [RES_C_1005X40]
R304  22R  [RES_C_1005X40]
R305  DNP/10k  [RES_C_1005X40]
R306  133k  [RES_C_1005X40]
R307  10k  [RES_C_1005X40]
R308  1.6k  [RES_C_1005X40]
R324  470k  [RES_C_1005X40]
R325  47k  [RES_C_1005X40]
R326  47k  [RES_C_1005X40]
R327  22R  [RES_C_1005X40]
R328  DNP/10k  [RES_C_1005X40]
R329  47k  [RES_C_1005X40]
R330  10k  [RES_C_1005X40]
R331  1.6k  [RES_C_1005X40]
R332  470k  [RES_C_1005X40]
R333  47k  [RES_C_1005X40]
R334  47k  [RES_C_1005X40]
R335  22R  [RES_C_1005X40]
R336  DNP/10k  [RES_C_1005X40]
R337  47k  [RES_C_1005X40]
R338  10k  [RES_C_1005X40]
R339  1.6k  [RES_C_1005X40]
U42  TPS259470ARPWR  [VQFN-HR-10]
U48  TPS259470ARPWR  [VQFN-HR-10]
U50  TPS259470ARPWR  [VQFN-HR-10]

### Nets
+5V_CAM: C177.2 C196.2 D13.1 JP7.2 R302.2 R303.2 U42.6(OUT)
+5V_OUT: C232.2 JP7.1 R301.2 U42.5(IN)
+5V_SOM: R305.2 R328.2 R336.2
+12V_IN: C286.2 C291.2 JP8.1 JP9.1 R324.2 R332.2 U48.5(IN) U50.5(IN)
+12V_Laser: C289.2 C290.2 D31.1 JP9.2 R333.2 R334.2 U50.6(OUT)
+12V_Photo: C284.2 C285.2 D30.1 JP8.2 R325.2 R326.2 U48.6(OUT)
GND: C177.1 C196.1 C232.1 C233.1 C257.1 C284.1 C285.1 C286.1 C287.1 C288.1 C289.1 C290.1 C291.1 C292.1 C293.1 D13.2 D30.2 D31.2 R306.1 R307.2 R308.1 R329.1 R330.2 R331.1 R337.1 R338.2 R339.1 U42.8 U48.8 U50.8
eFUSE_ILIM_5V_CAM: R308.2 U42.9 ; off-sheet eFUSE_ILIM_5V_CAM
eFUSE_ILIM_12V_Laser: R339.2 U50.9 ; off-sheet eFUSE_ILIM_12V_Laser
eFUSE_ILIM_12V_Photo: R331.2 U48.9 ; off-sheet eFUSE_ILIM_12V_Photo
POW_ONOFF_CAM: R304.2 ; off-sheet POW_ONOFF_CAM
POW_ONOFF_Laser: R335.2 ; off-sheet POW_ONOFF_Laser
POW_ONOFF_Photo: R327.2 ; off-sheet POW_ONOFF_Photo
NetC233_2: C233.2 U42.10
NetC257_2: C257.2 U42.7
NetC287_2: C287.2 U48.10
NetC288_2: C288.2 U48.7
NetC292_2: C292.2 U50.10
NetC293_2: C293.2 U50.7
NetR301_1: R301.1 R306.2 U42.2(OVLO/OVCSEL)
NetR302_1: R302.1 U42.3(PG/AUXOFF)
NetR303_1: R303.1 U42.4(PGTH/~{FLT})
NetR304_1: R304.1 R305.1 R307.1 U42.1(EN/UVLO)
NetR324_1: R324.1 R329.2 U48.2(OVLO/OVCSEL)
NetR325_1: R325.1 U48.3(PG/AUXOFF)
NetR326_1: R326.1 U48.4(PGTH/~{FLT})
NetR327_1: R327.1 R328.1 R330.1 U48.1(EN/UVLO)
NetR332_1: R332.1 R337.2 U50.2(OVLO/OVCSEL)
NetR333_1: R333.1 U50.3(PG/AUXOFF)
NetR334_1: R334.1 U50.4(PGTH/~{FLT})
NetR335_1: R335.1 R336.1 R338.1 U50.1(EN/UVLO)

### Notes on the sheet
- Undervoltage Protector: NONE
- Overvoltage Protector: 1.2*(133+470)/133=5.44V
- Slew Rate: 2000/2200=0.91V/ms
- I-LIM: 3334/1600=2.08A
- Overvoltage Protector: 1.2*(47+470)/47=13.2V
- Project:
- Sub-system:
- Design by:
- Sheet title:
- Sheet
- of
- Checked by:
- Approved by:
- Revision:
- Document No:
- Size:
- Date:
- A3

### Library data of the parts
C177 C196 C284 C285 C289 C290 = _CAP_C_High_2: CAP CHIP High Value
C232 C233 C257 C286-C288 C291-C293 = _CAP_C_2: CAP CHIP
D13 D30 D31 = SS54: DIODE SCHOTTKY 60V 3A DO214AA
JP7-JP9 = JUMPER
R301-R308 R324-R339 = _RES_B_2: RES

## Sheet SOM_POWER.SchDoc
size 420 x 297 mm; SheetNumber: 7; SheetTotal: 21
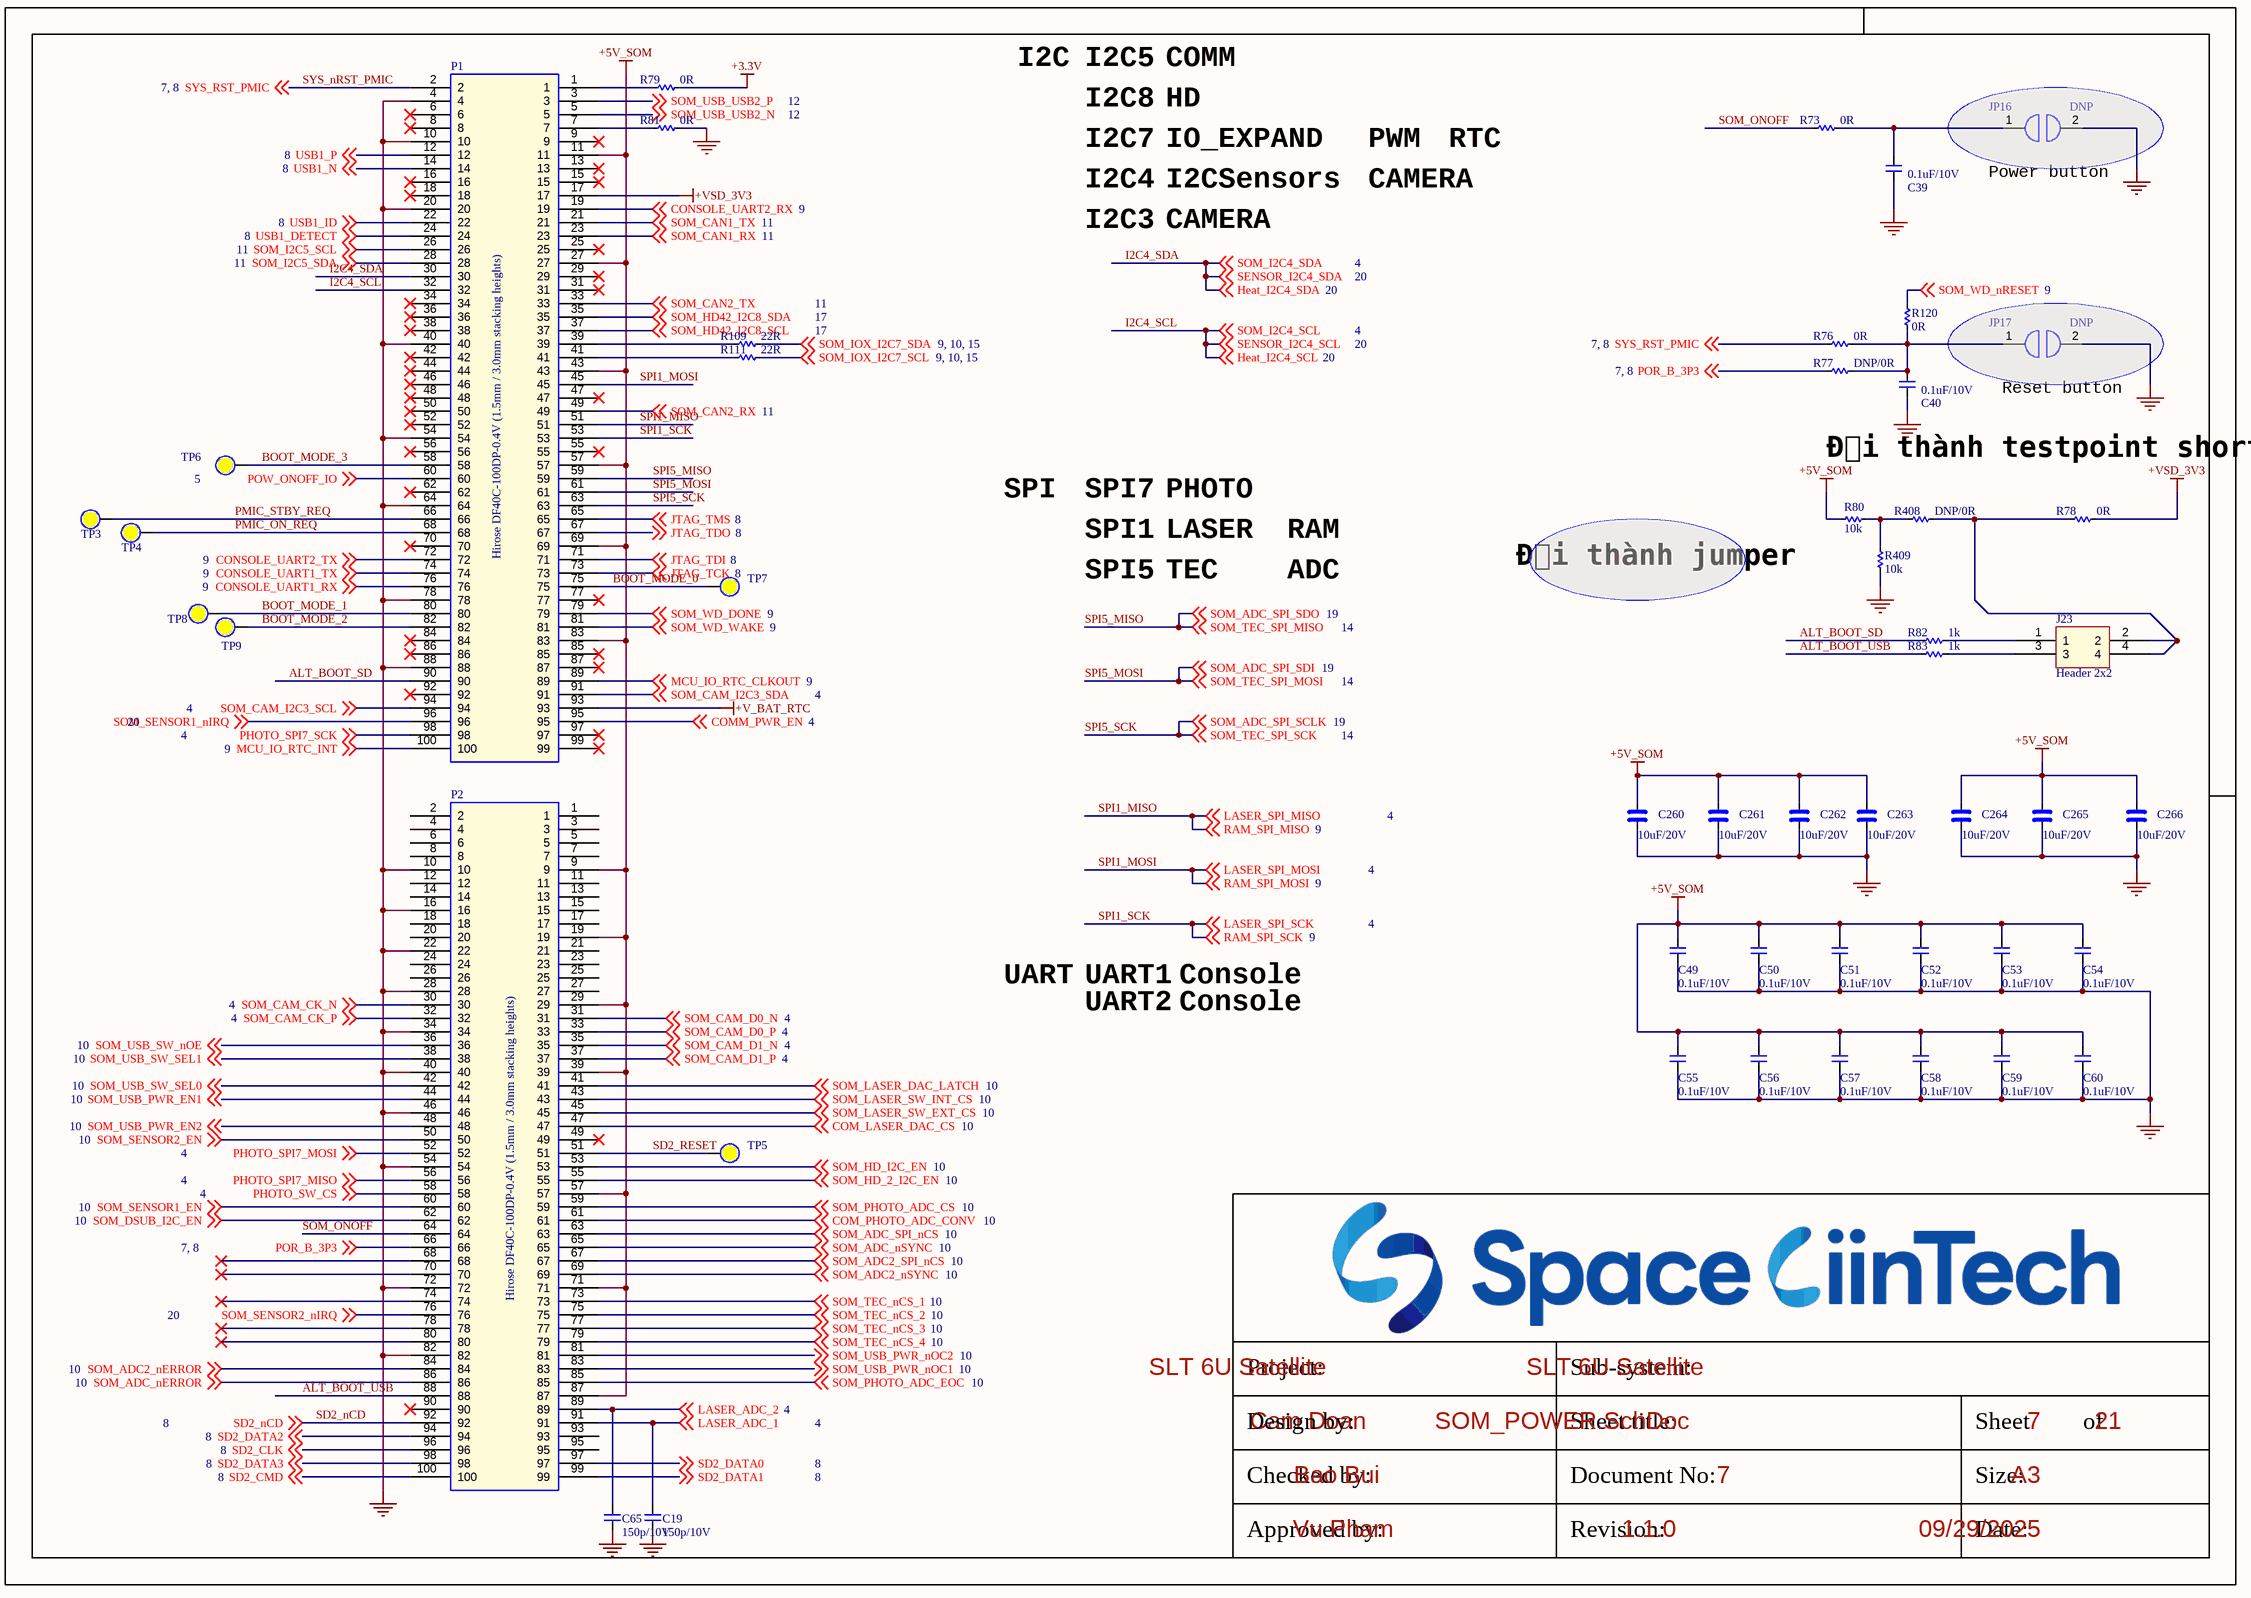
[diagram p5: SOM_POWER.SchDoc]

### Parts
C19  150p/10V  [CAP_C_1005X60]
C39  0.1uF/10V  [CAP_C_1005X60]
C40  0.1uF/10V  [CAP_C_1005X60]
C49  0.1uF/10V  [CAP_C_1005X60]
C50  0.1uF/10V  [CAP_C_1005X60]
C51  0.1uF/10V  [CAP_C_1005X60]
C52  0.1uF/10V  [CAP_C_1005X60]
C53  0.1uF/10V  [CAP_C_1005X60]
C54  0.1uF/10V  [CAP_C_1005X60]
C55  0.1uF/10V  [CAP_C_1005X60]
C56  0.1uF/10V  [CAP_C_1005X60]
C57  0.1uF/10V  [CAP_C_1005X60]
C58  0.1uF/10V  [CAP_C_1005X60]
C59  0.1uF/10V  [CAP_C_1005X60]
C60  0.1uF/10V  [CAP_C_1005X60]
C65  150p/10V  [CAP_C_1005X60]
C260  10uF/20V  [CAP_C_2012X110]
C261  10uF/20V  [CAP_C_2012X110]
C262  10uF/20V  [CAP_C_2012X110]
C263  10uF/20V  [CAP_C_2012X110]
C264  10uF/20V  [CAP_C_2012X110]
C265  10uF/20V  [CAP_C_2012X110]
C266  10uF/20V  [CAP_C_2012X110]
J23  Header 2x2  [CONN_54202-T0802ALF]
JP16  DNP  [TESTPOINT_SHORT_120X100_60]
JP17  DNP  [TESTPOINT_SHORT_120X100_60]
P1  Hirose DF40C-100DP-0.4V (1.5mm / 3.0mm stacking heights)  [B2B04M2X50R]
P2  Hirose DF40C-100DP-0.4V (1.5mm / 3.0mm stacking heights)  [B2B04M2X50R]
R73  0R  [RES_C_1005X40]
R76  0R  [RES_C_1005X40]
R77  DNP/0R  [RES_C_1005X40]
R78  0R  [RES_C_1005X40]
R79  0R  [RES_C_1005X40]
R80  10k  [RES_C_1005X40]
R81  0R  [RES_C_1005X40]
R82  1k  [RES_C_1005X40]
R83  1k  [RES_C_1005X40]
R109  22R  [RES_C_1005X40]
R111  22R  [RES_C_1005X40]
R120  0R  [RES_C_1005X40]
R408  DNP/0R  [RES_C_1005X40]
R409  10k  [RES_C_1005X40]
TP3  (no value)  [Testpoint_TH_D130H80]  (no BOM)
TP4  (no value)  [Testpoint_TH_D130H80]  (no BOM)
TP5  (no value)  [Testpoint_TH_D130H80]  (no BOM)
TP6  (no value)  [Testpoint_TH_D130H80]  (no BOM)
TP7  (no value)  [Testpoint_TH_D130H80]  (no BOM)
TP8  (no value)  [Testpoint_TH_D130H80]  (no BOM)
TP9  (no value)  [Testpoint_TH_D130H80]  (no BOM)

### Nets
+3.3V: R79.1
+5V_SOM: C49.2 C50.2 C51.2 C52.2 C53.2 C54.2 C55.2 C56.2 C57.2 C58.2 C59.2 C60.2 C260.1 C261.1 C262.1 C263.1 C264.1 C265.1 C266.1 P1.11 P1.27 P1.43 P1.57 P1.69 P1.83 P2.9 P2.19 P2.29 P2.39 P2.57 P2.71 P2.87 R80.1
+V_BAT_RTC: P1.93
+VSD_3V3: P1.17 R78.1
GND: C19.2 C39.1 C40.1 C49.1 C50.1 C51.1 C52.1 C53.1 C54.1 C55.1 C56.1 C57.1 C58.1 C59.1 C60.1 C65.2 C260.2 C261.2 C262.2 C263.2 C264.2 C265.2 C266.2 JP16.2 JP17.2 P1.4 P1.10 P1.20 P1.40 P1.54 P1.64 P1.78 P1.88 P2.10 P2.16 P2.22 P2.28 P2.34 P2.40 P2.46 P2.54 P2.72 P2.82 R81.1 R409.2
ALT_BOOT_SD: P1.90 R82.2
ALT_BOOT_USB: P2.88 R83.2
BOOT_MODE_0: P1.75 TP7.0
BOOT_MODE_1: P1.80 TP8.0
BOOT_MODE_2: P1.82 TP9.0
BOOT_MODE_3: P1.58 TP6.0
COM_LASER_DAC_CS: P2.47 ; off-sheet COM_LASER_DAC_CS
COM_PHOTO_ADC_CONV: P2.61 ; off-sheet COM_PHOTO_ADC_CONV
COMM_PWR_EN: P1.95 ; off-sheet COMM_PWR_EN
CONSOLE_UART1_RX: P1.76 ; off-sheet CONSOLE_UART1_RX
CONSOLE_UART1_TX: P1.74 ; off-sheet CONSOLE_UART1_TX
CONSOLE_UART2_RX: P1.19 ; off-sheet CONSOLE_UART2_RX
CONSOLE_UART2_TX: P1.72 ; off-sheet CONSOLE_UART2_TX
I2C4_SCL: P1.32 ; off-sheet SOM_I2C4_SCL, off-sheet SENSOR_I2C4_SCL, off-sheet Heat_I2C4_SCL  [also labelled Heat_I2C4_SCL, SENSOR_I2C4_SCL, SOM_I2C4_SCL]
I2C4_SDA: P1.30 ; off-sheet SOM_I2C4_SDA, off-sheet SENSOR_I2C4_SDA, off-sheet Heat_I2C4_SDA  [also labelled Heat_I2C4_SDA, SENSOR_I2C4_SDA, SOM_I2C4_SDA]
JTAG_TCK: P1.73 ; off-sheet JTAG_TCK
JTAG_TDI: P1.71 ; off-sheet JTAG_TDI
JTAG_TDO: P1.67 ; off-sheet JTAG_TDO
JTAG_TMS: P1.65 ; off-sheet JTAG_TMS
LASER_ADC_1: C19.1 P2.91 ; off-sheet LASER_ADC_1
LASER_ADC_2: C65.1 P2.89 ; off-sheet LASER_ADC_2
MCU_IO_RTC_CLKOUT: P1.89 ; off-sheet MCU_IO_RTC_CLKOUT
MCU_IO_RTC_INT: P1.100 ; off-sheet MCU_IO_RTC_INT
PHOTO_SPI7_MISO: P2.56 ; off-sheet PHOTO_SPI7_MISO
PHOTO_SPI7_MOSI: P2.52 ; off-sheet PHOTO_SPI7_MOSI
PHOTO_SPI7_SCK: P1.98 ; off-sheet PHOTO_SPI7_SCK
PHOTO_SW_CS: P2.58 ; off-sheet PHOTO_SW_CS
PMIC_ON_REQ: P1.68 TP4.0
PMIC_STBY_REQ: P1.66 TP3.0
POR_B_3P3: P2.66 R77.2 ; off-sheet POR_B_3P3
POW_ONOFF_IO: P1.60 ; off-sheet POW_ONOFF_IO
SD2_CLK: P2.96 ; off-sheet SD2_CLK
SD2_CMD: P2.100 ; off-sheet SD2_CMD
SD2_DATA0: P2.97 ; off-sheet SD2_DATA0
SD2_DATA1: P2.99 ; off-sheet SD2_DATA1
SD2_DATA2: P2.94 ; off-sheet SD2_DATA2
SD2_DATA3: P2.98 ; off-sheet SD2_DATA3
SD2_nCD: P2.92 ; off-sheet SD2_nCD
SD2_RESET: P2.51 TP5.0
SOM_ADC2_nERROR: P2.84 ; off-sheet SOM_ADC2_nERROR
SOM_ADC2_nSYNC: P2.69 ; off-sheet SOM_ADC2_nSYNC
SOM_ADC2_SPI_nCS: P2.67 ; off-sheet SOM_ADC2_SPI_nCS
SOM_ADC_nERROR: P2.86 ; off-sheet SOM_ADC_nERROR
SOM_ADC_nSYNC: P2.65 ; off-sheet SOM_ADC_nSYNC
SOM_ADC_SPI_nCS: P2.63 ; off-sheet SOM_ADC_SPI_nCS
SOM_ADC_SPI_SCLK: P1.63 ; off-sheet SOM_TEC_SPI_SCK, off-sheet SOM_ADC_SPI_SCLK  [also labelled SOM_TEC_SPI_SCK, SPI5_SCK]  [project net SOM_TEC_SPI6_SCK]
SOM_ADC_SPI_SDI: P1.61 ; off-sheet SOM_TEC_SPI_MOSI, off-sheet SOM_ADC_SPI_SDI  [also labelled SOM_TEC_SPI_MOSI, SPI5_MOSI]  [project net SOM_TEC_SPI6_MOSI]
SOM_ADC_SPI_SDO: P1.59 ; off-sheet SOM_ADC_SPI_SDO, off-sheet SOM_TEC_SPI_MISO  [also labelled SOM_TEC_SPI_MISO, SPI5_MISO]  [project net SOM_TEC_SPI6_MISO]
SOM_CAM_CK_N: P2.30 ; off-sheet SOM_CAM_CK_N
SOM_CAM_CK_P: P2.32 ; off-sheet SOM_CAM_CK_P
SOM_CAM_D0_N: P2.31 ; off-sheet SOM_CAM_D0_N
SOM_CAM_D0_P: P2.33 ; off-sheet SOM_CAM_D0_P
SOM_CAM_D1_N: P2.35 ; off-sheet SOM_CAM_D1_N
SOM_CAM_D1_P: P2.37 ; off-sheet SOM_CAM_D1_P
SOM_CAM_I2C3_SCL: P1.94 ; off-sheet SOM_CAM_I2C3_SCL
SOM_CAM_I2C3_SDA: P1.91 ; off-sheet SOM_CAM_I2C3_SDA
SOM_CAN1_RX: P1.23 ; off-sheet SOM_CAN1_RX
SOM_CAN1_TX: P1.21 ; off-sheet SOM_CAN1_TX
SOM_CAN2_RX: P1.49 ; off-sheet SOM_CAN2_RX
SOM_CAN2_TX: P1.33 ; off-sheet SOM_CAN2_TX
SOM_DSUB_I2C_EN: P2.62 ; off-sheet SOM_DSUB_I2C_EN
SOM_HD42_I2C8_SCL: P1.37 ; off-sheet SOM_HD42_I2C8_SCL
SOM_HD42_I2C8_SDA: P1.35 ; off-sheet SOM_HD42_I2C8_SDA
SOM_HD_2_I2C_EN: P2.55 ; off-sheet SOM_HD_2_I2C_EN
SOM_HD_I2C_EN: P2.53 ; off-sheet SOM_HD_I2C_EN
SOM_I2C5_SCL: P1.26 ; off-sheet SOM_I2C5_SCL
SOM_I2C5_SDA: P1.28 ; off-sheet SOM_I2C5_SDA
SOM_IOX_I2C7_SCL: R111.2 ; off-sheet SOM_IOX_I2C7_SCL
SOM_IOX_I2C7_SDA: R109.2 ; off-sheet SOM_IOX_I2C7_SDA
SOM_LASER_DAC_LATCH: P2.41 ; off-sheet SOM_LASER_DAC_LATCH
SOM_LASER_SW_EXT_CS: P2.45 ; off-sheet SOM_LASER_SW_EXT_CS
SOM_LASER_SW_INT_CS: P2.43 ; off-sheet SOM_LASER_SW_INT_CS
SOM_ONOFF: P2.64 R73.2
SOM_PHOTO_ADC_CS: P2.59 ; off-sheet SOM_PHOTO_ADC_CS
SOM_PHOTO_ADC_EOC: P2.85 ; off-sheet SOM_PHOTO_ADC_EOC
SOM_SENSOR1_EN: P2.60 ; off-sheet SOM_SENSOR1_EN
SOM_SENSOR1_nIRQ: P1.96 ; off-sheet SOM_SENSOR1_nIRQ
SOM_SENSOR2_EN: P2.50 ; off-sheet SOM_SENSOR2_EN
SOM_SENSOR2_nIRQ: P2.76 ; off-sheet SOM_SENSOR2_nIRQ
SOM_TEC_nCS_1: P2.73 ; off-sheet SOM_TEC_nCS_1
SOM_TEC_nCS_2: P2.75 ; off-sheet SOM_TEC_nCS_2
SOM_TEC_nCS_3: P2.77 ; off-sheet SOM_TEC_nCS_3
SOM_TEC_nCS_4: P2.79 ; off-sheet SOM_TEC_nCS_4
SOM_USB_PWR_EN1: P2.44 ; off-sheet SOM_USB_PWR_EN1
SOM_USB_PWR_EN2: P2.48 ; off-sheet SOM_USB_PWR_EN2
SOM_USB_PWR_nOC1: P2.83 ; off-sheet SOM_USB_PWR_nOC1
SOM_USB_PWR_nOC2: P2.81 ; off-sheet SOM_USB_PWR_nOC2
SOM_USB_SW_nOE: P2.36 ; off-sheet SOM_USB_SW_nOE
SOM_USB_SW_SEL0: P2.42 ; off-sheet SOM_USB_SW_SEL0
SOM_USB_SW_SEL1: P2.38 ; off-sheet SOM_USB_SW_SEL1
SOM_USB_USB2_N: P1.5 ; off-sheet SOM_USB_USB2_N
SOM_USB_USB2_P: P1.3 ; off-sheet SOM_USB_USB2_P
SOM_WD_DONE: P1.79 ; off-sheet SOM_WD_DONE  [project net WD_DONE]
SOM_WD_nRESET: R120.1 ; off-sheet SOM_WD_nRESET  [project net WD_nRESET]
SOM_WD_WAKE: P1.81 ; off-sheet SOM_WD_WAKE  [project net WD_WAKE]
SPI1_MISO: P1.51 ; off-sheet LASER_SPI_MISO, off-sheet RAM_SPI_MISO  [also labelled LASER_SPI_MISO, RAM_SPI_MISO]
SPI1_MOSI: P1.45 ; off-sheet LASER_SPI_MOSI, off-sheet RAM_SPI_MOSI  [also labelled LASER_SPI_MOSI, RAM_SPI_MOSI]
SPI1_SCK: P1.53 ; off-sheet LASER_SPI_SCK, off-sheet RAM_SPI_SCK  [also labelled LASER_SPI_SCK, RAM_SPI_SCK]
SYS_nRST_PMIC: P1.2 R76.2 ; off-sheet SYS_RST_PMIC  [also labelled SYS_RST_PMIC]
USB1_DETECT: P1.24 ; off-sheet USB1_DETECT
USB1_ID: P1.22 ; off-sheet USB1_ID
USB1_N: P1.14 ; off-sheet USB1_N
USB1_P: P1.12 ; off-sheet USB1_P
NetC39_2: C39.2 JP16.1 R73.1
NetC40_2: C40.2 JP17.1 R76.1 R77.1 R120.2
NetJ23_1: J23.1 R82.1
NetJ23_2: J23.2 J23.4 R78.2 R408.1
NetJ23_3: J23.3 R83.1
NetP1_1: P1.1 R79.2
NetP1_7: P1.7 R81.2
NetP1_39: P1.39 R109.1
NetP1_41: P1.41 R111.1
NetR80_2: R80.2 R408.2 R409.1

Not connected (* = marked no-connect by the designer): P1 6* 8* 9* 13* 15* 16* 18* 25* 29* 31* 34* 36* 38* 42* 44* 46* 47* 48* 50* 52* 55* 56* 62* 70* 77* 84* 85* 86* 87* 92* 97* 99*; P2 1 2 3 4 5 6 7 8 11 12 13 14 15 17 18 20 21 23 24 25 26 27 49* 68* 70* 74* 78* 80* 90* 93 95

### Notes on the sheet
- I2C
- I2C8
- I2C5
- HD
- COMM
- I2C4
- I2C7
- I2CSensors
- IO_EXPAND
- CAMERA
- PWM
- RTC
- (near JP16) Power button
- I2C3
- (near JP17) Reset button
- Đổi thành testpoint short
- SPI
- SPI7
- PHOTO
- SPI5
- SPI1
- TEC
- LASER
- ADC
- RAM
- Đổi thành jumper
- UART
- UART1
- Console
- UART2
- Project:
- Sub-system:
- Design by:
- Sheet title:
- Sheet
- of
- Checked by:
- Approved by:
- Revision:
- Document No:
- Size:
- Date:
- A3

### Library data of the parts
C19 C39 C40 C49-C60 C65 = _CAP_C_2: CAP CHIP
C260-C266 = _CAP_C_High_2: CAP CHIP High Value
J23 = Header 2x2_Z
JP16 JP17 = JUMPER
P1 = Hirose DF40C-100DP-0_0.4V: P/N: 182K10004S; PCB Footprint: B2B04M2X50P; CLABCONF0: =SB-UCMIMX93
P2 = Hirose DF40C-100DP-0_1.4V: P/N: 182K10004S; PCB Footprint: B2B04M2X50P; CLABCONF0: =SB-UCMIMX93
R73 R76-R83 R109 R111 R120 R408 R409 = _RES_B_2: RES
TP3-TP9 = Test Point: Solder: NF

## Sheet SOM_BOOT.SchDoc
size 420 x 297 mm; SheetNumber: 8; SheetTotal: 20
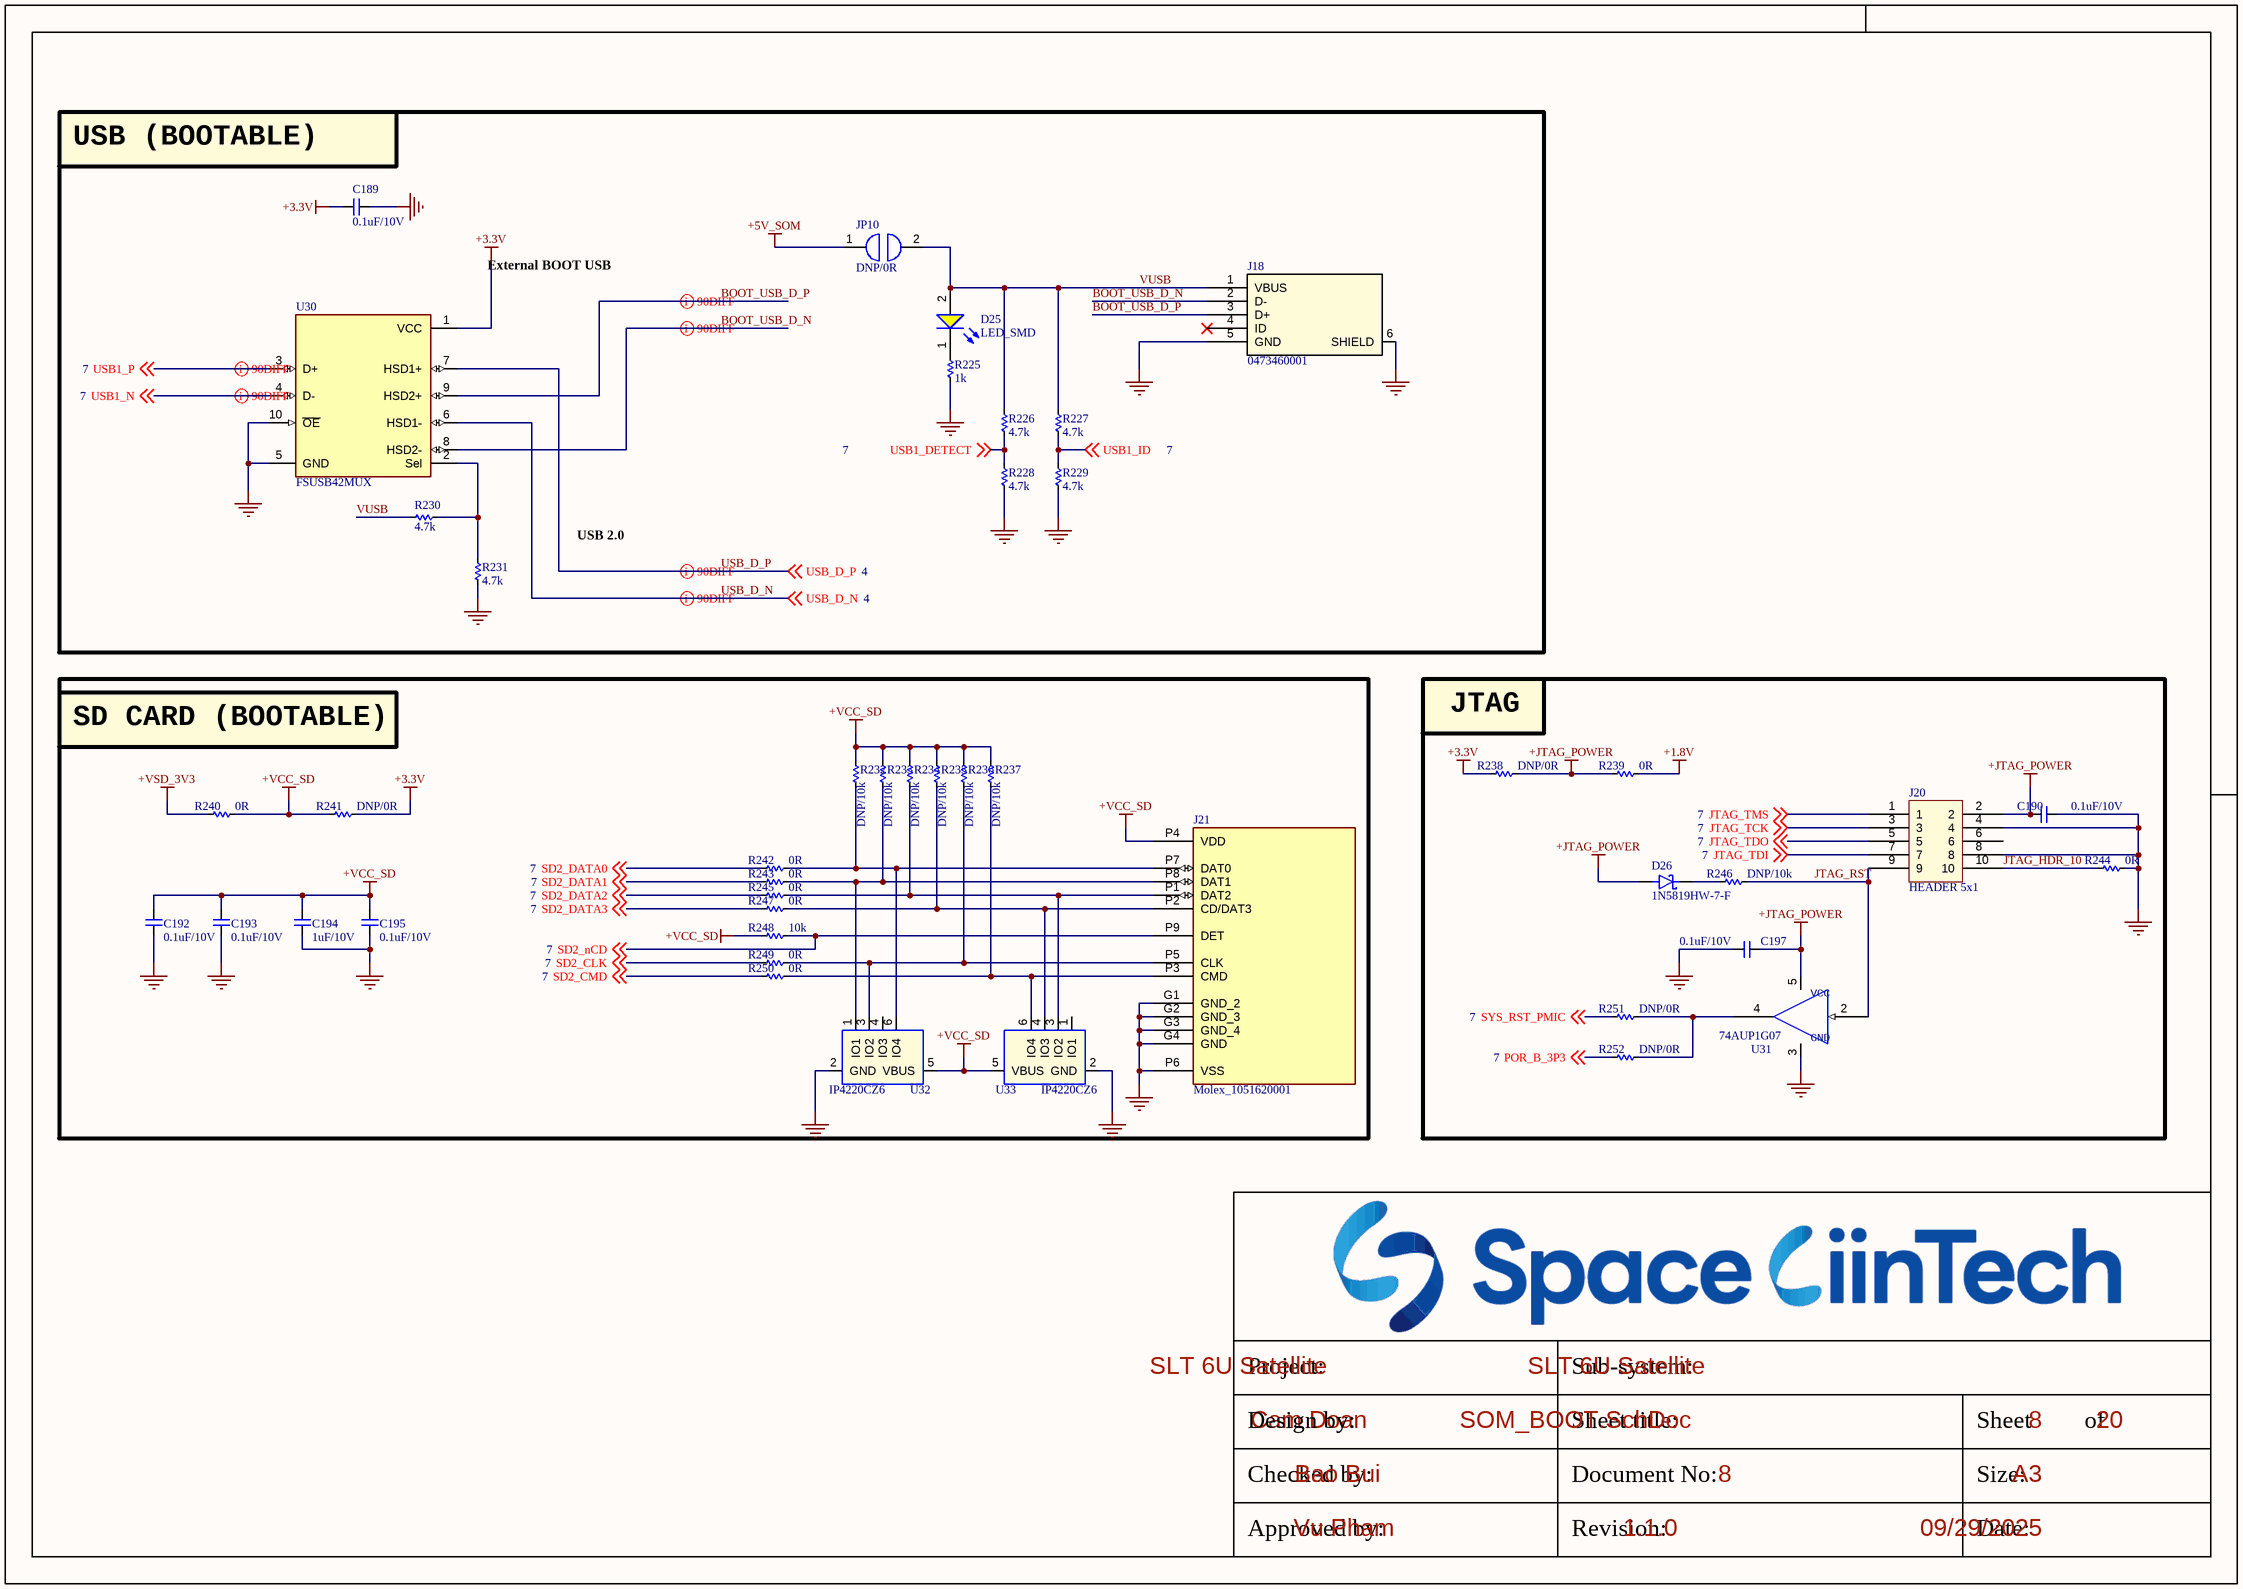
[diagram p6: SOM_BOOT.SchDoc]

### Parts
C189  0.1uF/10V  [CAP_C_1005X60]
C190  0.1uF/10V  [CAP_C_1005X60]
C192  0.1uF/10V  [CAP_C_1005X60]
C193  0.1uF/10V  [CAP_C_1005X60]
C194  1uF/10V  [CAP_C_1005X60]
C195  0.1uF/10V  [CAP_C_1005X60]
C197  0.1uF/10V  [CAP_C_1005X60]
D25  LED_SMD  [LED_0603]
D26  1N5819HW-7-F  [SOD3717X145N]
J18  0473460001  [47346-0001_MOL]
J20  HEADER 5x1  [CONN_54202-T0805ALF]
J21  Molex_1051620001  [Molex_1051620001]
JP10  DNP/0R  [RES_C_1608X60]
R225  1k  [RES_C_1005X40]
R226  4.7k  [RES_C_1005X40]
R227  4.7k  [RES_C_1005X40]
R228  4.7k  [RES_C_1005X40]
R229  4.7k  [RES_C_1005X40]
R230  4.7k  [RES_C_1005X40]
R231  4.7k  [RES_C_1005X40]
R232  DNP/10k  [RES_C_1005X40]
R233  DNP/10k  [RES_C_1005X40]
R234  DNP/10k  [RES_C_1005X40]
R235  DNP/10k  [RES_C_1005X40]
R236  DNP/10k  [RES_C_1005X40]
R237  DNP/10k  [RES_C_1005X40]
R238  DNP/0R  [RES_C_1005X40]
R239  0R  [RES_C_1005X40]
R240  0R  [RES_C_1005X40]
R241  DNP/0R  [RES_C_1005X40]
R242  0R  [RES_C_1005X40]
R243  0R  [RES_C_1005X40]
R244  0R  [RES_C_1005X40]
R245  0R  [RES_C_1005X40]
R246  DNP/10k  [RES_C_1005X40]
R247  0R  [RES_C_1005X40]
R248  10k  [RES_C_1005X40]
R249  0R  [RES_C_1005X40]
R250  0R  [RES_C_1005X40]
R251  DNP/0R  [RES_C_1005X40]
R252  DNP/0R  [RES_C_1005X40]
U30  FSUSB42MUX  [FP-846AP-MFG]
U31  74AUP1G07  [SOT-23-5_DIO]
U32  IP4220CZ6  [SOT95P280X145-6N]
U33  IP4220CZ6  [SOT95P280X145-6N]

### Blocks framed on the sheet
USB (BOOTABLE): C189 D25 J18 JP10 R225-R231 U30
SD CARD (BOOTABLE): C192-C195 J21 R232-R237 R240-R243 R245 R247-R250 U32 U33
JTAG: C190 C197 D26 J20 R238 R239 R244 R246 R251 R252 U31

### Nets
+1.8V: R239.1
+3.3V: C189.2 R238.2 R241.2 U30.1(VCC)
+5V_SOM: JP10.1
+JTAG_POWER: C190.2 C197.1 D26.2(A) J20.2 R238.1 R239.2 U31.5(VCC)
+VCC_SD: C192.2 C193.2 C194.2 C195.2 J21.P4(VDD) R232.2 R233.2 R234.2 R235.2 R236.2 R237.2 R240.2 R241.1 R248.1 U32.5(VBUS) U33.5(VBUS)
+VSD_3V3: R240.1
GND: C189.1 C190.1 C192.1 C193.1 C194.1 C195.1 C197.2 J18.5(GND) J18.6(SHIELD) J20.4 J20.8 J21.G1(GND_2) J21.G2(GND_3) J21.G3(GND_4) J21.G4(GND) J21.P6(VSS) R225.1 R228.1 R229.1 R231.1 R244.1 U30.5(GND) U30.10(~{OE}) U31.3(GND) U32.2(GND) U33.2(GND)
BOOT_USB_D_N: J18.2(D-) U30.8(HSD2-)
BOOT_USB_D_P: J18.3(D+) U30.9(HSD2+)
JTAG_HDR_10: J20.10 R244.2
JTAG_RST: J20.9 R246.1 U31.2(IN)
JTAG_TCK: J20.3 ; off-sheet JTAG_TCK
JTAG_TDI: J20.7 ; off-sheet JTAG_TDI
JTAG_TDO: J20.5 ; off-sheet JTAG_TDO
JTAG_TMS: J20.1 ; off-sheet JTAG_TMS
POR_B_3P3: R252.2 ; off-sheet POR_B_3P3
SD2_CLK: R249.1 ; off-sheet SD2_CLK
SD2_CMD: R250.1 ; off-sheet SD2_CMD
SD2_DATA0: R242.1 ; off-sheet SD2_DATA0
SD2_DATA1: R243.1 ; off-sheet SD2_DATA1
SD2_DATA2: R245.1 ; off-sheet SD2_DATA2
SD2_DATA3: R247.1 ; off-sheet SD2_DATA3
SD2_nCD: J21.P9(DET) R248.2 ; off-sheet SD2_nCD
SYS_RST_PMIC: R251.2 ; off-sheet SYS_RST_PMIC  [project net SYS_nRST_PMIC]
USB1_DETECT: R226.1 R228.2 ; off-sheet USB1_DETECT
USB1_ID: R227.1 R229.2 ; off-sheet USB1_ID
USB1_N: U30.4(D-) ; off-sheet USB1_N
USB1_P: U30.3(D+) ; off-sheet USB1_P
USB_D_N: U30.6(HSD1-) ; off-sheet USB_D_N
USB_D_P: U30.7(HSD1+) ; off-sheet USB_D_P
VUSB: D25.2(A) J18.1(VBUS) JP10.2 R226.2 R227.2 R230.1
NetD25_1: D25.1(K) R225.2
NetD26_1: D26.1(K) R246.2
NetJ21_P1: J21.P1(DAT2) R234.1 R245.2 U33.3(IO2)
NetJ21_P2: J21.P2(CD/DAT3) R235.1 R247.2 U33.4(IO3)
NetJ21_P3: J21.P3(CMD) R237.1 R250.2 U33.6(IO4)
NetJ21_P5: J21.P5(CLK) R236.1 R249.2 U32.3(IO2)
NetJ21_P7: J21.P7(DAT0) R232.1 R242.2 U32.6(IO4)
NetJ21_P8: J21.P8(DAT1) R233.1 R243.2 U32.1(IO1)
NetR230_2: R230.2 R231.2 U30.2(Sel)
NetR251_1: R251.1 R252.1 U31.4(OUT)

Not connected (* = marked no-connect by the designer): J18 4(ID)*; J20 6; U32 4(IO3); U33 1(IO1)

### Layout directives
differential pair; differential pair class DIFF90: BOOT_USB_D_N, BOOT_USB_D_P, USB1_N, USB1_P, USB_D_N, USB_D_P

### Notes on the sheet
- External BOOT USB
- USB 2.0
- Project:
- Sub-system:
- Design by:
- Sheet title:
- Sheet
- of
- Checked by:
- Approved by:
- Revision:
- Document No:
- Size:
- Date:
- A3

### Library data of the parts
C189 C190 C192-C195 C197 = _CAP_C_2: CAP CHIP
D26 = DIODE SCHOTTKY: DIODE SCHOTTKY 40V 1A SOD123
J18 = USB_micro: No Description Available; Mfr_Name: Molex Connector Corporation; RefDes: RefDes; Type: Type
J20 = Header 5x2_Z
J21 = Molex_1051620001: 9 (8 + 1) Position Card Connector Secure Digital - microSDâ„¢ Surface Mount, Right Angle Gold; MF: Molex; SnapEDA_Link: https://www.snapeda.com/parts/1051620001/Molex/view-part/?ref=snap; Package: None; Value: *; MP: 1051620001; Check_prices: https://www.snapeda.com/parts/1051620001/Molex/view-part/?ref=eda
JP10 = JUMPER
R225-R252 = _RES_B_2: RES
U30 = CMP-07103-000004-1: IC USB SWITCH DPDT 10MSOP; Voltage: 4.3V; Current: 100mA; Number of Inputs: 2; Supply Type: Single; Number of Outputs: 4; Data Rate: 480Mbps; On-State Resistance: 6.5R; Min Supply Voltage: 3V; Package Quantity: 1; Length: 3mm; Radiation Hardening: No; Number of Pins: 10; Width: 3mm; Number of Channels: 2; REACH SVHC: No SVHC; Lead Free: Lead Free; Max Operating Temperature: 85°C; Min Operating Temperature: -40°C; Packaging: Tape and Reel; Throw Configuration: DPDT; Operating Supply Voltage: 4.3V; Max Supply Voltage: 4.3V; Mount: Surface Mount; Case/Package: MSOP; Weight: 0.1125g; Height: 0.85mm
U31 = 74AUP1G07 , buffer ,LV: P/N: 106D20071S; PCB Footprint: SC70; CLABCONF0: =SB-UCMIMX93
U32 U33 = IP4220CZ6_0: P/N: 132D42200S; PCB Footprint: SOT23-6L; CLABCONF0: =SB-UCMIMX93

## Sheet SOM_Console.SchDoc
size 420 x 297 mm; SheetNumber: 9; SheetTotal: 21
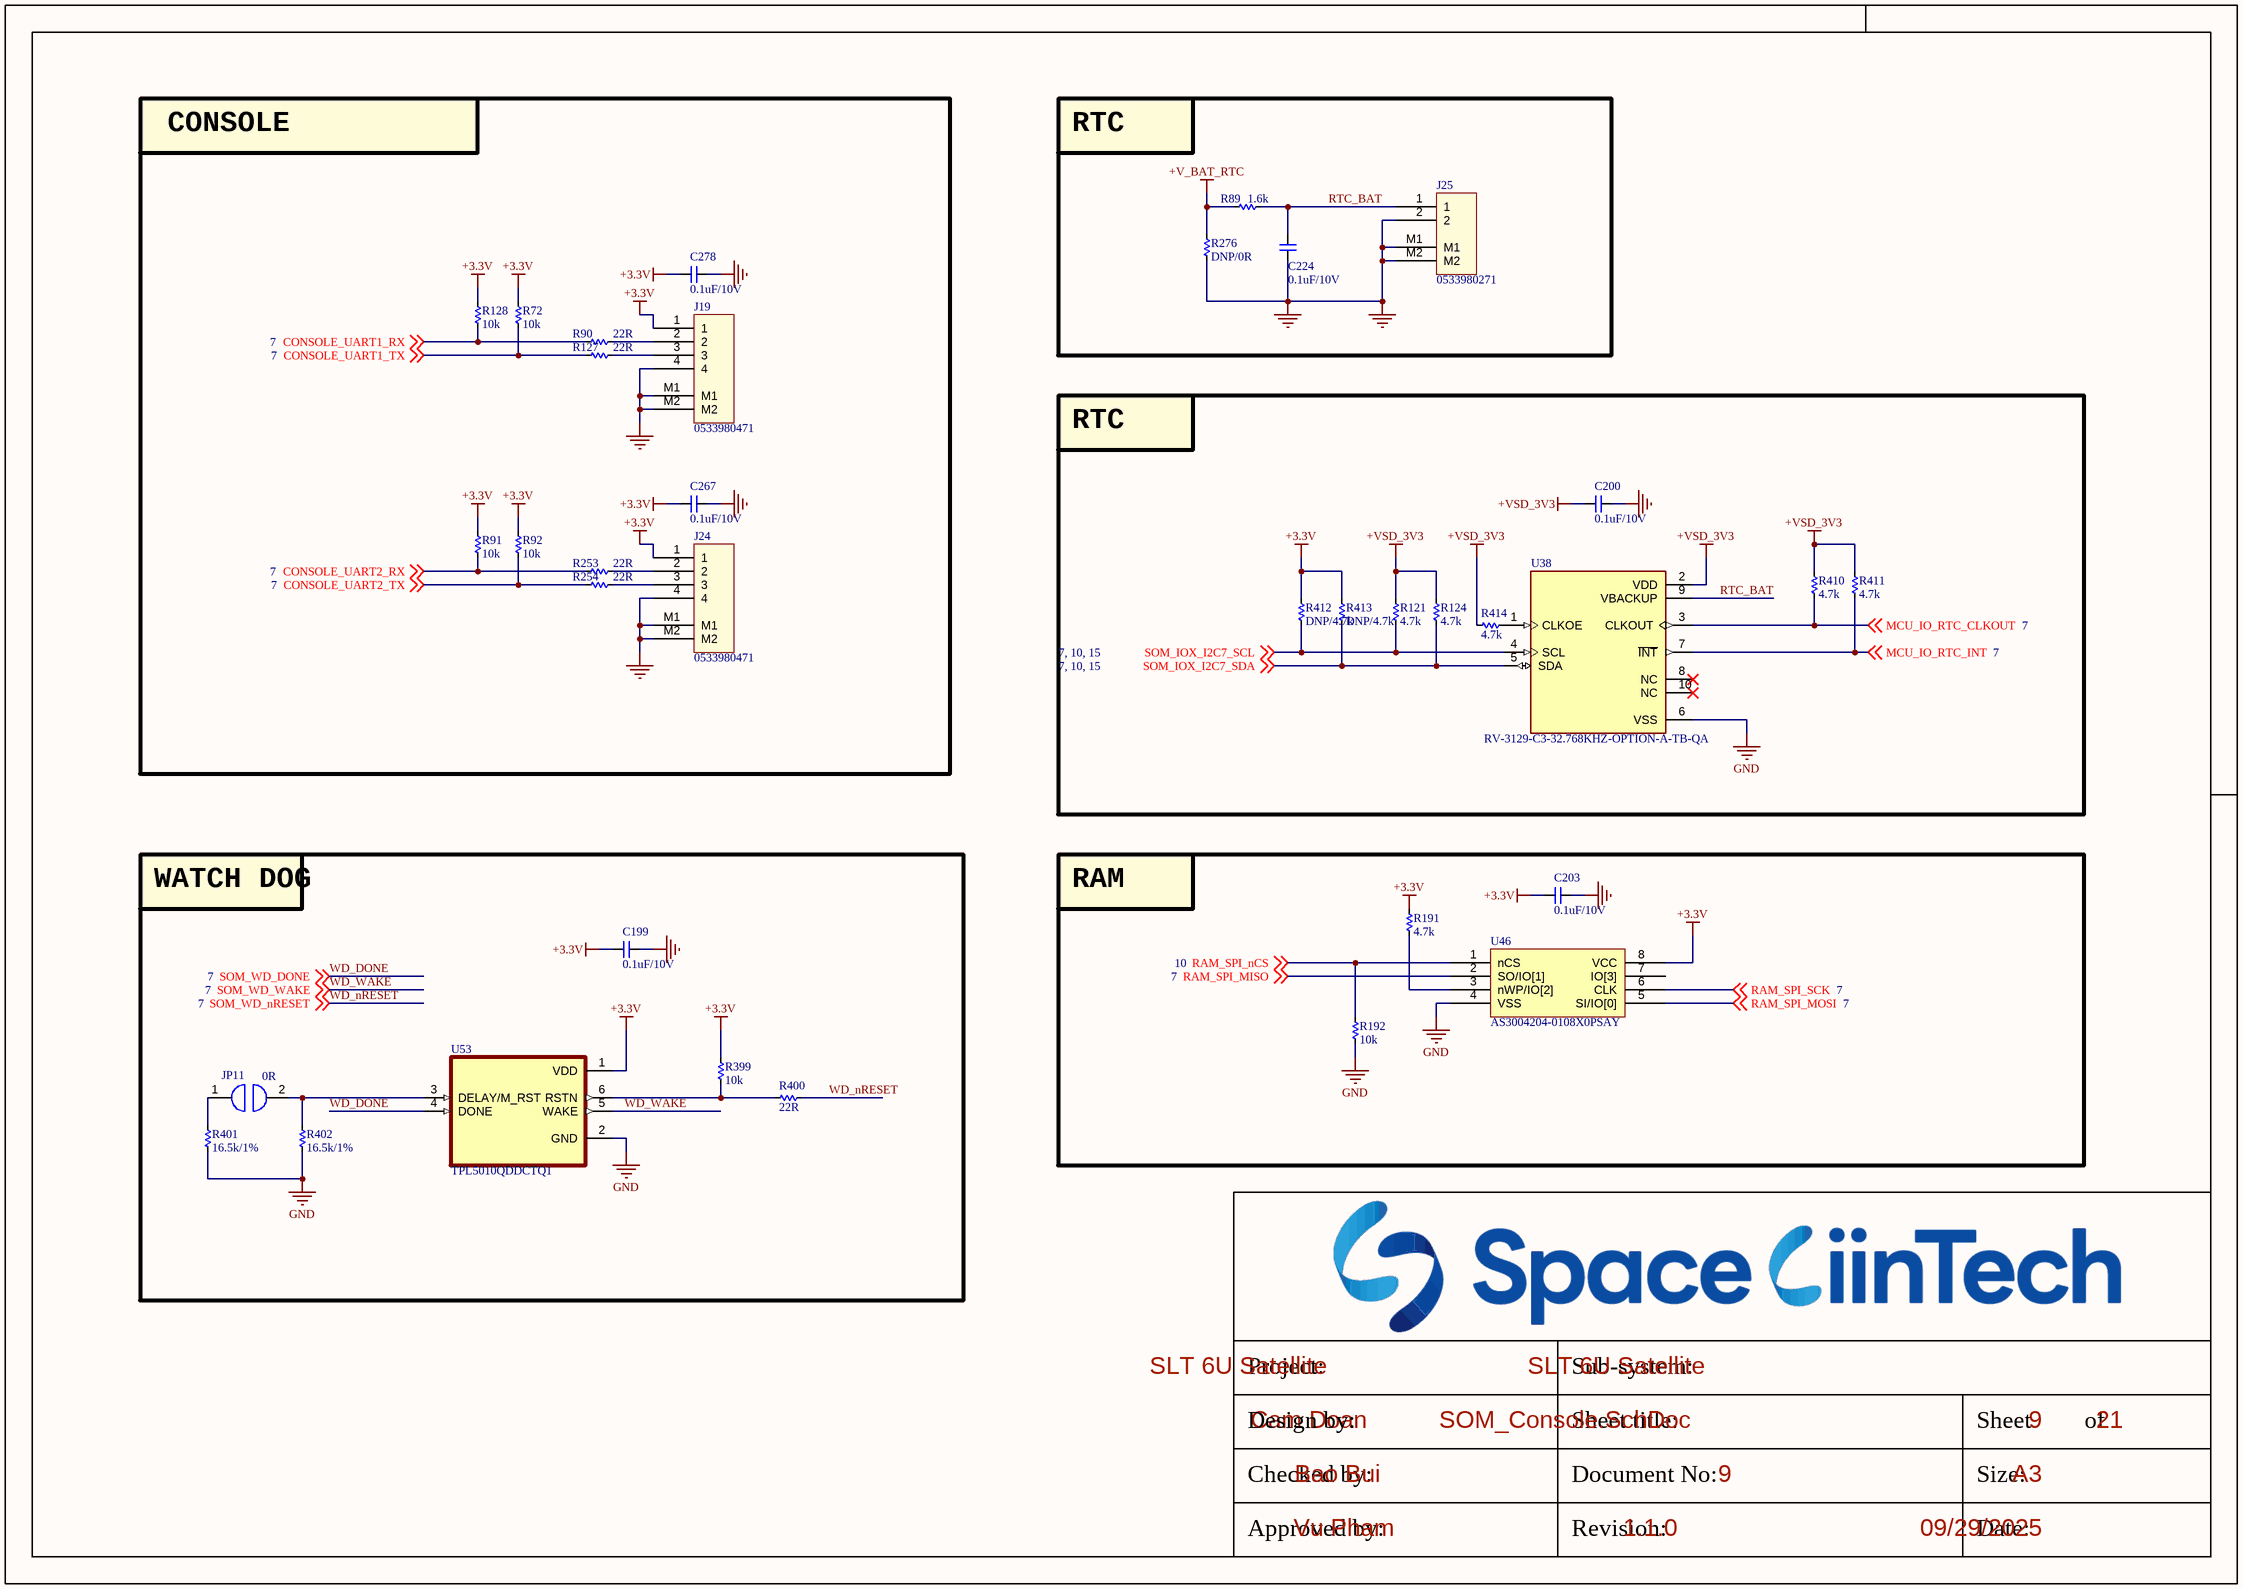
[diagram p7: SOM_Console.SchDoc]

### Parts
C199  0.1uF/10V  [CAP_C_1005X60]
C200  0.1uF/10V  [CAP_C_1005X60]
C203  0.1uF/10V  [CAP_C_1005X60]
C224  0.1uF/10V  [CAP_C_1005X60]
C267  0.1uF/10V  [CAP_C_1005X60]
C278  0.1uF/10V  [CAP_C_1005X60]
J19  0533980471  [MOLEX_0533980471]
J24  0533980471  [MOLEX_0533980471]
J25  0533980271  [MOLEX_0533980271]
JP11  0R  [RES_C_1608X60]
R72  10k  [RES_C_1005X40]
R89  1.6k  [RES_C_1005X40]
R90  22R  [RES_C_1005X40]
R91  10k  [RES_C_1005X40]
R92  10k  [RES_C_1005X40]
R121  4.7k  [RES_C_1005X40]
R124  4.7k  [RES_C_1005X40]
R127  22R  [RES_C_1005X40]
R128  10k  [RES_C_1005X40]
R191  4.7k  [RES_C_1005X40]
R192  10k  [RES_C_1005X40]
R253  22R  [RES_C_1005X40]
R254  22R  [RES_C_1005X40]
R276  DNP/0R  [RES_C_1005X40]
R399  10k  [RES_C_1005X40]
R400  22R  [RES_C_1005X40]
R401  16.5k/1%  [RES_C_1005X40]
R402  16.5k/1%  [RES_C_1005X40]
R410  4.7k  [RES_C_1005X40]
R411  4.7k  [RES_C_1005X40]
R412  DNP/4.7k  [RES_C_1005X40]
R413  DNP/4.7k  [RES_C_1005X40]
R414  4.7k  [RES_C_1005X40]
U38  RV-3129-C3-32.768KHZ-OPTION-A-TB-QA  [IC_RV-3129-C3_32.768KHZ_OPTION_A_TB_QA]
U46  AS3004204-0108X0PSAY  [SOIC127P790X216-8]
U53  TPL5010QDDCTQ1  [SOT95P280X145-6N]

### Blocks framed on the sheet
CONSOLE: C267 C278 J19 J24 R72 R90-R92 R127 R128 R253 R254
RTC: C224 J25 R89 R276
RTC: C200 R121 R124 R410-R414 U38
WATCH DOG: C199 JP11 R399-R402 U53
RAM: C203 R191 R192 U46

### Nets
+3.3V: C199.2 C203.2 C267.2 C278.2 J19.1 J24.1 R72.2 R91.2 R92.2 R128.2 R191.2 R399.2 R412.2 R413.2 U46.8(VCC) U53.1(VDD)
+V_BAT_RTC: R89.1 R276.1
+VSD_3V3: C200.2 R121.2 R124.2 R410.2 R411.2 R414.2 U38.2(VDD)
GND: C199.1 C200.1 C203.1 C224.1 C267.1 C278.1 J19.4 J19.M1 J19.M2 J24.4 J24.M1 J24.M2 J25.2 J25.M1 J25.M2 R192.1 R276.2 R401.1 R402.1 U38.6(VSS) U46.4(VSS) U53.2(GND)
CONSOLE_UART1_RX: R90.2 R128.1 ; off-sheet CONSOLE_UART1_RX
CONSOLE_UART1_TX: R72.1 R127.2 ; off-sheet CONSOLE_UART1_TX
CONSOLE_UART2_RX: R91.1 R253.2 ; off-sheet CONSOLE_UART2_RX
CONSOLE_UART2_TX: R92.1 R254.2 ; off-sheet CONSOLE_UART2_TX
MCU_IO_RTC_CLKOUT: R410.1 U38.3(CLKOUT) ; off-sheet MCU_IO_RTC_CLKOUT
MCU_IO_RTC_INT: R411.1 U38.7(~{INT}) ; off-sheet MCU_IO_RTC_INT
RAM_SPI_MISO: U46.2(SO/IO[1]) ; off-sheet RAM_SPI_MISO  [project net SPI1_MISO]
RAM_SPI_MOSI: U46.5(SI/IO[0]) ; off-sheet RAM_SPI_MOSI  [project net SPI1_MOSI]
RAM_SPI_nCS: R192.2 U46.1(nCS) ; off-sheet RAM_SPI_nCS
RAM_SPI_SCK: U46.6(CLK) ; off-sheet RAM_SPI_SCK  [project net SPI1_SCK]
RTC_BAT: C224.2 J25.1 R89.2 U38.9(VBACKUP)
SOM_IOX_I2C7_SCL: R121.1 R412.1 U38.4(SCL) ; off-sheet SOM_IOX_I2C7_SCL
SOM_IOX_I2C7_SDA: R124.1 R413.1 U38.5(SDA) ; off-sheet SOM_IOX_I2C7_SDA
WD_DONE: U53.4(DONE) ; off-sheet SOM_WD_DONE  [also labelled SOM_WD_DONE]
WD_nRESET: R400.1 ; off-sheet SOM_WD_nRESET  [also labelled SOM_WD_nRESET]
WD_WAKE: U53.5(WAKE) ; off-sheet SOM_WD_WAKE  [also labelled SOM_WD_WAKE]
NetJ19_2: J19.2 R90.1
NetJ19_3: J19.3 R127.1
NetJ24_2: J24.2 R253.1
NetJ24_3: J24.3 R254.1
NetJP11_1: JP11.1 R401.2
NetJP11_2: JP11.2 R402.2 U53.3(DELAY/M_RST)
NetR191_1: R191.1 U46.3(nWP/IO[2])
NetR399_1: R399.1 R400.2 U53.6(RSTN)
NetR414_1: R414.1 U38.1(CLKOE)

Not connected (* = marked no-connect by the designer): U38 8(NC)* 10(NC)*; U46 7(IO[3])

### Notes on the sheet
- Project:
- Sub-system:
- Design by:
- Sheet title:
- Sheet
- of
- Checked by:
- Approved by:
- Revision:
- Document No:
- Size:
- Date:
- A3

### Library data of the parts
C199 C200 C203 C224 C267 C278 = _CAP_C_2: CAP CHIP
J19 J24 = Header 4x1_2M
J25 = Header 2x1_2M
JP11 = JUMPER
R72 R89-R92 R121 R124 R127 R128 R191 R192 R253 R254 R276 R399-R402 R410-R414 = _RES_B_2: RES
U38 = RV-3129-C3_32.768KHZ_OPTION_A_TB_QA: Real-Time Clock Module, Temperature compensated, in 2.5 x 3.7 mm package; MF: Micro Crystal; MP: RV-3129-C3 32.768KHZ OPTION A TB QA; SnapEDA_Link: https://www.snapeda.com/parts/RV-3129-C3%2032.768KHZ%20OPTION%20A%20TB%20QA/Micro+Crystal/view-part/?ref=snap; Package: QFN-10 Micro Crystal; Value: *; Check_prices: https://www.snapeda.com/parts/RV-3129-C3%2032.768KHZ%20OPTION%20A%20TB%20QA/Micro+Crystal/view-part/?ref=eda
U46 = IC_RAM_AS3004204-0108X0PSAY
U53 = TPL5010QDDCTQ1: Package: None; Price: None; Value: *; MP: TPL5010QDDCTQ1; Availability: Unavailable

## Sheet IO_EXPAND.SchDoc
size 420 x 297 mm; SheetNumber: 10; SheetTotal: 21
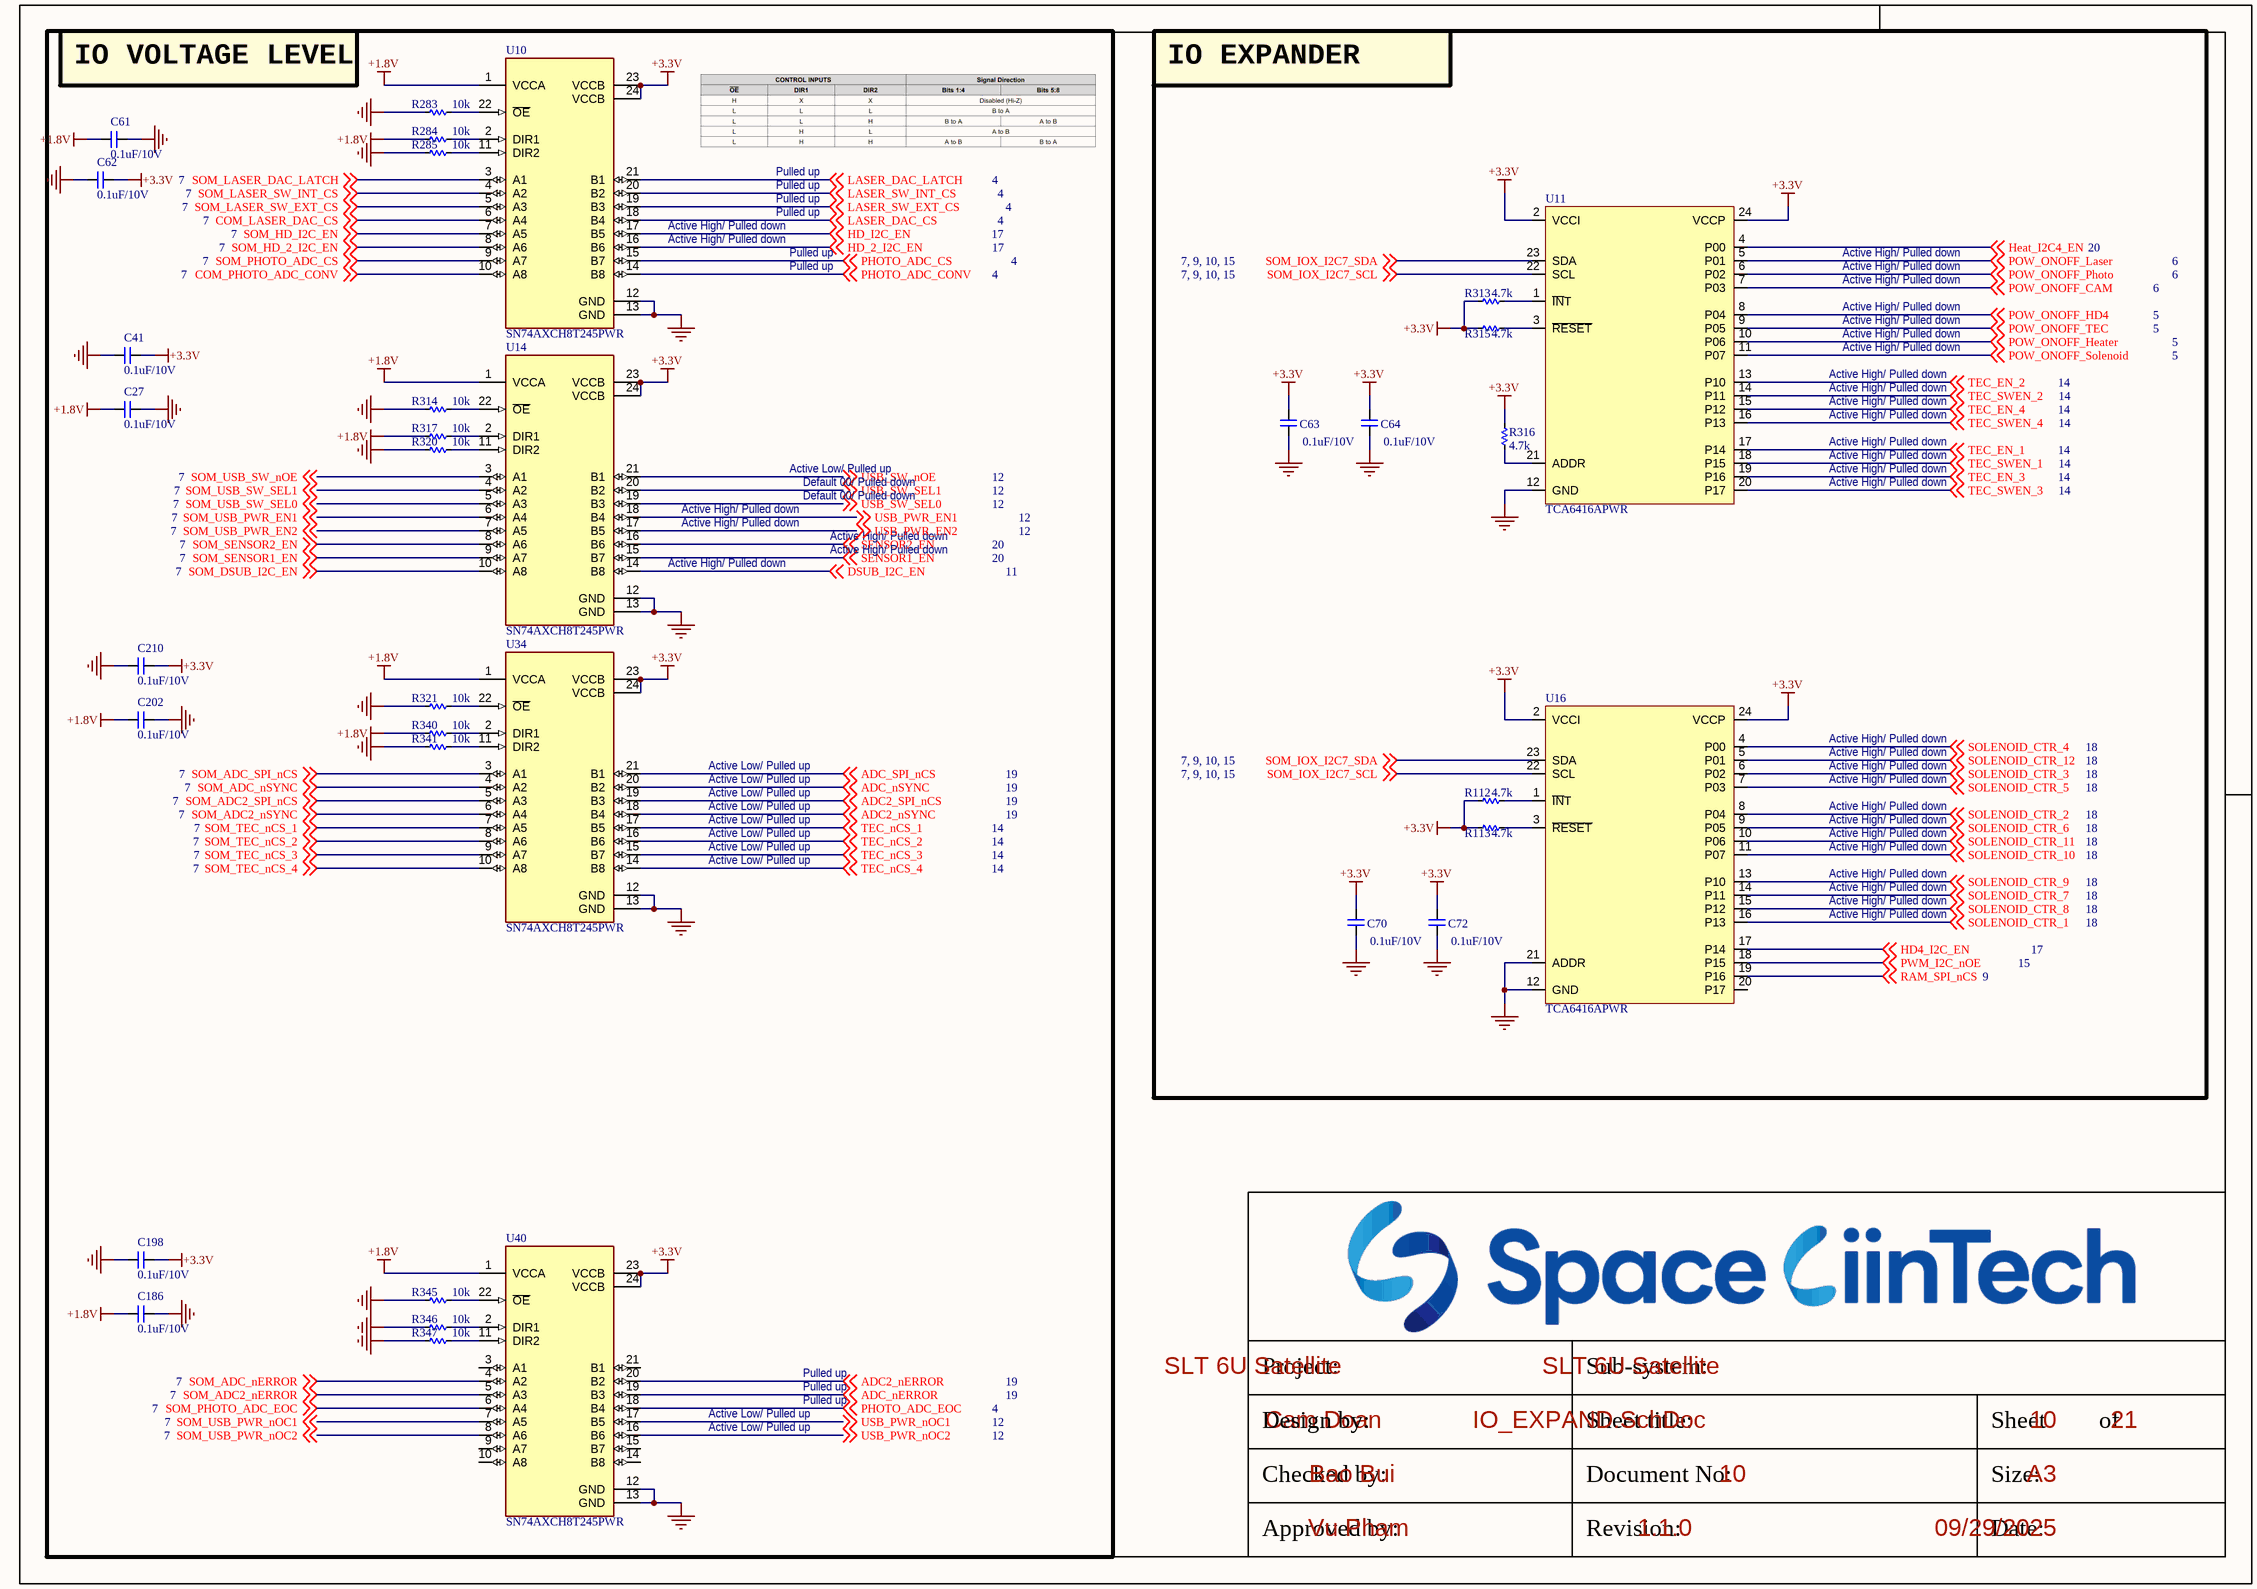
[diagram p8: IO_EXPAND.SchDoc]

### Parts
C27  0.1uF/10V  [CAP_C_1005X60]
C41  0.1uF/10V  [CAP_C_1005X60]
C61  0.1uF/10V  [CAP_C_1005X60]
C62  0.1uF/10V  [CAP_C_1005X60]
C63  0.1uF/10V  [CAP_C_1005X60]
C64  0.1uF/10V  [CAP_C_1005X60]
C70  0.1uF/10V  [CAP_C_1005X60]
C72  0.1uF/10V  [CAP_C_1005X60]
C186  0.1uF/10V  [CAP_C_1005X60]
C198  0.1uF/10V  [CAP_C_1005X60]
C202  0.1uF/10V  [CAP_C_1005X60]
C210  0.1uF/10V  [CAP_C_1005X60]
R112  4.7k  [RES_C_1005X40]
R113  4.7k  [RES_C_1005X40]
R283  10k  [RES_C_1005X40]
R284  10k  [RES_C_1005X40]
R285  10k  [RES_C_1005X40]
R313  4.7k  [RES_C_1005X40]
R314  10k  [RES_C_1005X40]
R315  4.7k  [RES_C_1005X40]
R316  4.7k  [RES_C_1005X40]
R317  10k  [RES_C_1005X40]
R320  10k  [RES_C_1005X40]
R321  10k  [RES_C_1005X40]
R340  10k  [RES_C_1005X40]
R341  10k  [RES_C_1005X40]
R345  10k  [RES_C_1005X40]
R346  10k  [RES_C_1005X40]
R347  10k  [RES_C_1005X40]
U10  SN74AXCH8T245PWR  [SOP65P640X120-24N]
U11  TCA6416APWR  [SOP65P440W-24N]
U14  SN74AXCH8T245PWR  [SOP65P640X120-24N]
U16  TCA6416APWR  [SOP65P440W-24N]
U34  SN74AXCH8T245PWR  [SOP65P640X120-24N]
U40  SN74AXCH8T245PWR  [SOP65P640X120-24N]

### Blocks framed on the sheet
IO VOLTAGE LEVEL: C27 C41 C61 C62 C186 C198 C202 C210 R283-R285 R314 R317 R320 R321 R340 R341 R345-R347 U10 U14 U34 U40
IO EXPANDER: C63 C64 C70 C72 R112 R113 R313 R315 R316 U11 U16

### Nets
+1.8V: C27.2 C61.2 C186.2 C202.2 R284.2 R317.2 R340.2 U10.1(VCCA) U14.1(VCCA) U34.1(VCCA) U40.1(VCCA)
+3.3V: C41.2 C62.2 C63.2 C64.2 C70.2 C72.2 C198.2 C210.2 R112.1 R113.1 R313.1 R315.1 R316.2 U10.23(VCCB) U10.24(VCCB) U11.2(VCCI) U11.24(VCCP) U14.23(VCCB) U14.24(VCCB) U16.2(VCCI) U16.24(VCCP) U34.23(VCCB) U34.24(VCCB) U40.23(VCCB) U40.24(VCCB)
GND: C27.1 C41.1 C61.1 C62.1 C63.1 C64.1 C70.1 C72.1 C186.1 C198.1 C202.1 C210.1 R283.2 R285.2 R314.2 R320.2 R321.2 R341.2 R345.2 R346.2 R347.2 U10.12(GND) U10.13(GND) U11.12(GND) U14.12(GND) U14.13(GND) U16.12(GND) U16.21(ADDR) U34.12(GND) U34.13(GND) U40.12(GND) U40.13(GND)
ADC2_nERROR: U40.20(B2) ; off-sheet ADC2_nERROR
ADC2_nSYNC: U34.18(B4) ; off-sheet ADC2_nSYNC
ADC2_SPI_nCS: U34.19(B3) ; off-sheet ADC2_SPI_nCS
ADC_nERROR: U40.19(B3) ; off-sheet ADC_nERROR
ADC_nSYNC: U34.20(B2) ; off-sheet ADC_nSYNC
ADC_SPI_nCS: U34.21(B1) ; off-sheet ADC_SPI_nCS
COM_LASER_DAC_CS: U10.6(A4) ; off-sheet COM_LASER_DAC_CS
COM_PHOTO_ADC_CONV: U10.10(A8) ; off-sheet COM_PHOTO_ADC_CONV
DSUB_I2C_EN: U14.14(B8) ; off-sheet DSUB_I2C_EN
HD4_I2C_EN: U16.17(P14) ; off-sheet HD4_I2C_EN
HD_2_I2C_EN: U10.16(B6) ; off-sheet HD_2_I2C_EN
HD_I2C_EN: U10.17(B5) ; off-sheet HD_I2C_EN
Heat_I2C4_EN: U11.4(P00) ; off-sheet Heat_I2C4_EN
LASER_DAC_CS: U10.18(B4) ; off-sheet LASER_DAC_CS
LASER_DAC_LATCH: U10.21(B1) ; off-sheet LASER_DAC_LATCH
LASER_SW_EXT_CS: U10.19(B3) ; off-sheet LASER_SW_EXT_CS
LASER_SW_INT_CS: U10.20(B2) ; off-sheet LASER_SW_INT_CS
PHOTO_ADC_CONV: U10.14(B8) ; off-sheet PHOTO_ADC_CONV
PHOTO_ADC_CS: U10.15(B7) ; off-sheet PHOTO_ADC_CS
PHOTO_ADC_EOC: U40.18(B4) ; off-sheet PHOTO_ADC_EOC
POW_ONOFF_CAM: U11.7(P03) ; off-sheet POW_ONOFF_CAM
POW_ONOFF_HD4: U11.8(P04) ; off-sheet POW_ONOFF_HD4
POW_ONOFF_Heater: U11.10(P06) ; off-sheet POW_ONOFF_Heater
POW_ONOFF_Laser: U11.5(P01) ; off-sheet POW_ONOFF_Laser
POW_ONOFF_Photo: U11.6(P02) ; off-sheet POW_ONOFF_Photo
POW_ONOFF_Solenoid: U11.11(P07) ; off-sheet POW_ONOFF_Solenoid
POW_ONOFF_TEC: U11.9(P05) ; off-sheet POW_ONOFF_TEC
PWM_I2C_nOE: U16.18(P15) ; off-sheet PWM_I2C_nOE
RAM_SPI_nCS: U16.19(P16) ; off-sheet RAM_SPI_nCS
SENSOR1_EN: U14.15(B7) ; off-sheet SENSOR1_EN
SENSOR2_EN: U14.16(B6) ; off-sheet SENSOR2_EN
SOLENOID_CTR_1: U16.16(P13) ; off-sheet SOLENOID_CTR_1
SOLENOID_CTR_2: U16.8(P04) ; off-sheet SOLENOID_CTR_2
SOLENOID_CTR_3: U16.6(P02) ; off-sheet SOLENOID_CTR_3
SOLENOID_CTR_4: U16.4(P00) ; off-sheet SOLENOID_CTR_4
SOLENOID_CTR_5: U16.7(P03) ; off-sheet SOLENOID_CTR_5
SOLENOID_CTR_6: U16.9(P05) ; off-sheet SOLENOID_CTR_6
SOLENOID_CTR_7: U16.14(P11) ; off-sheet SOLENOID_CTR_7
SOLENOID_CTR_8: U16.15(P12) ; off-sheet SOLENOID_CTR_8
SOLENOID_CTR_9: U16.13(P10) ; off-sheet SOLENOID_CTR_9
SOLENOID_CTR_10: U16.11(P07) ; off-sheet SOLENOID_CTR_10
SOLENOID_CTR_11: U16.10(P06) ; off-sheet SOLENOID_CTR_11
SOLENOID_CTR_12: U16.5(P01) ; off-sheet SOLENOID_CTR_12
SOM_ADC2_nERROR: U40.5(A3) ; off-sheet SOM_ADC2_nERROR
SOM_ADC2_nSYNC: U34.6(A4) ; off-sheet SOM_ADC2_nSYNC
SOM_ADC2_SPI_nCS: U34.5(A3) ; off-sheet SOM_ADC2_SPI_nCS
SOM_ADC_nERROR: U40.4(A2) ; off-sheet SOM_ADC_nERROR
SOM_ADC_nSYNC: U34.4(A2) ; off-sheet SOM_ADC_nSYNC
SOM_ADC_SPI_nCS: U34.3(A1) ; off-sheet SOM_ADC_SPI_nCS
SOM_DSUB_I2C_EN: U14.10(A8) ; off-sheet SOM_DSUB_I2C_EN
SOM_HD_2_I2C_EN: U10.8(A6) ; off-sheet SOM_HD_2_I2C_EN
SOM_HD_I2C_EN: U10.7(A5) ; off-sheet SOM_HD_I2C_EN
SOM_IOX_I2C7_SCL: U11.22(SCL) U16.22(SCL) ; off-sheet SOM_IOX_I2C7_SCL
SOM_IOX_I2C7_SDA: U11.23(SDA) U16.23(SDA) ; off-sheet SOM_IOX_I2C7_SDA
SOM_LASER_DAC_LATCH: U10.3(A1) ; off-sheet SOM_LASER_DAC_LATCH
SOM_LASER_SW_EXT_CS: U10.5(A3) ; off-sheet SOM_LASER_SW_EXT_CS
SOM_LASER_SW_INT_CS: U10.4(A2) ; off-sheet SOM_LASER_SW_INT_CS
SOM_PHOTO_ADC_CS: U10.9(A7) ; off-sheet SOM_PHOTO_ADC_CS
SOM_PHOTO_ADC_EOC: U40.6(A4) ; off-sheet SOM_PHOTO_ADC_EOC
SOM_SENSOR1_EN: U14.9(A7) ; off-sheet SOM_SENSOR1_EN
SOM_SENSOR2_EN: U14.8(A6) ; off-sheet SOM_SENSOR2_EN
SOM_TEC_nCS_1: U34.7(A5) ; off-sheet SOM_TEC_nCS_1
SOM_TEC_nCS_2: U34.8(A6) ; off-sheet SOM_TEC_nCS_2
SOM_TEC_nCS_3: U34.9(A7) ; off-sheet SOM_TEC_nCS_3
SOM_TEC_nCS_4: U34.10(A8) ; off-sheet SOM_TEC_nCS_4
SOM_USB_PWR_EN1: U14.6(A4) ; off-sheet SOM_USB_PWR_EN1
SOM_USB_PWR_EN2: U14.7(A5) ; off-sheet SOM_USB_PWR_EN2
SOM_USB_PWR_nOC1: U40.7(A5) ; off-sheet SOM_USB_PWR_nOC1
SOM_USB_PWR_nOC2: U40.8(A6) ; off-sheet SOM_USB_PWR_nOC2
SOM_USB_SW_nOE: U14.3(A1) ; off-sheet SOM_USB_SW_nOE
SOM_USB_SW_SEL0: U14.5(A3) ; off-sheet SOM_USB_SW_SEL0
SOM_USB_SW_SEL1: U14.4(A2) ; off-sheet SOM_USB_SW_SEL1
TEC_EN_1: U11.17(P14) ; off-sheet TEC_EN_1
TEC_EN_2: U11.13(P10) ; off-sheet TEC_EN_2
TEC_EN_3: U11.19(P16) ; off-sheet TEC_EN_3
TEC_EN_4: U11.15(P12) ; off-sheet TEC_EN_4
TEC_nCS_1: U34.17(B5) ; off-sheet TEC_nCS_1
TEC_nCS_2: U34.16(B6) ; off-sheet TEC_nCS_2
TEC_nCS_3: U34.15(B7) ; off-sheet TEC_nCS_3
TEC_nCS_4: U34.14(B8) ; off-sheet TEC_nCS_4
TEC_SWEN_1: U11.18(P15) ; off-sheet TEC_SWEN_1
TEC_SWEN_2: U11.14(P11) ; off-sheet TEC_SWEN_2
TEC_SWEN_3: U11.20(P17) ; off-sheet TEC_SWEN_3
TEC_SWEN_4: U11.16(P13) ; off-sheet TEC_SWEN_4
USB_PWR_EN1: U14.18(B4) ; off-sheet USB_PWR_EN1
USB_PWR_EN2: U14.17(B5) ; off-sheet USB_PWR_EN2
USB_PWR_nOC1: U40.17(B5) ; off-sheet USB_PWR_nOC1
USB_PWR_nOC2: U40.16(B6) ; off-sheet USB_PWR_nOC2
USB_SW_nOE: U14.21(B1) ; off-sheet USB_SW_nOE
USB_SW_SEL0: U14.19(B3) ; off-sheet USB_SW_SEL0
USB_SW_SEL1: U14.20(B2) ; off-sheet USB_SW_SEL1
NetR112_2: R112.2 U16.1(~{IN}T)
NetR113_2: R113.2 U16.3(~{RESET})
NetR283_1: R283.1 U10.22(~{OE})
NetR284_1: R284.1 U10.2(DIR1)
NetR285_1: R285.1 U10.11(DIR2)
NetR313_2: R313.2 U11.1(~{IN}T)
NetR314_1: R314.1 U14.22(~{OE})
NetR315_2: R315.2 U11.3(~{RESET})
NetR316_1: R316.1 U11.21(ADDR)
NetR317_1: R317.1 U14.2(DIR1)
NetR320_1: R320.1 U14.11(DIR2)
NetR321_1: R321.1 U34.22(~{OE})
NetR340_1: R340.1 U34.2(DIR1)
NetR341_1: R341.1 U34.11(DIR2)
NetR345_1: R345.1 U40.22(~{OE})
NetR346_1: R346.1 U40.2(DIR1)
NetR347_1: R347.1 U40.11(DIR2)

Not connected (* = marked no-connect by the designer): U16 20(P17); U40 3(A1) 9(A7) 10(A8) 14(B8) 15(B7) 21(B1)

### Notes on the sheet
- Pulled up
- Active High/ Pulled down
- (near U14) Active Low/ Pulled up
- (near U14) Default 00/ Pulled down
- Active Low/ Pulled up
- Project:
- Sub-system:
- Design by:
- Sheet title:
- Sheet
- of
- Checked by:
- Approved by:
- Revision:
- Document No:
- Size:
- Date:
- A3

### Library data of the parts
C27 C41 C61-C64 C70 C72 C186 C198 C202 C210 = _CAP_C_2: CAP CHIP
R112 R113 R283-R285 R313-R317 R320 R321 R340 R341 R345-R347 = _RES_B_2: RES
U10 U14 U34 U40 = IC_voltage_level_SN74AXCH8T245PWR: 8-Bit Dual-Supply Bus Transceiver; MF: Texas Instruments; MP: SN74AXCH8T245PWR; Value: *; Check_prices: https://www.snapeda.com/parts/SN74AXCH8T245PWR/Texas+Instruments/view-part/?ref=eda; SnapEDA_Link: https://www.snapeda.com/parts/SN74AXCH8T245PWR/Texas+Instruments/view-part/?ref=snap; Price: None; Availability: In Stock; Purchase-URL: https://pricing.snapeda.com/search/part/SN74AXCH8T245PWR/?ref=eda; Package: TSSOP-24 Texas Instruments
U11 U16 = IC_I2Cto16IO_TCA6416APWR